# Altium project BMD_RevB_IDL_18_014.PrjPcb (part 1 of 2)
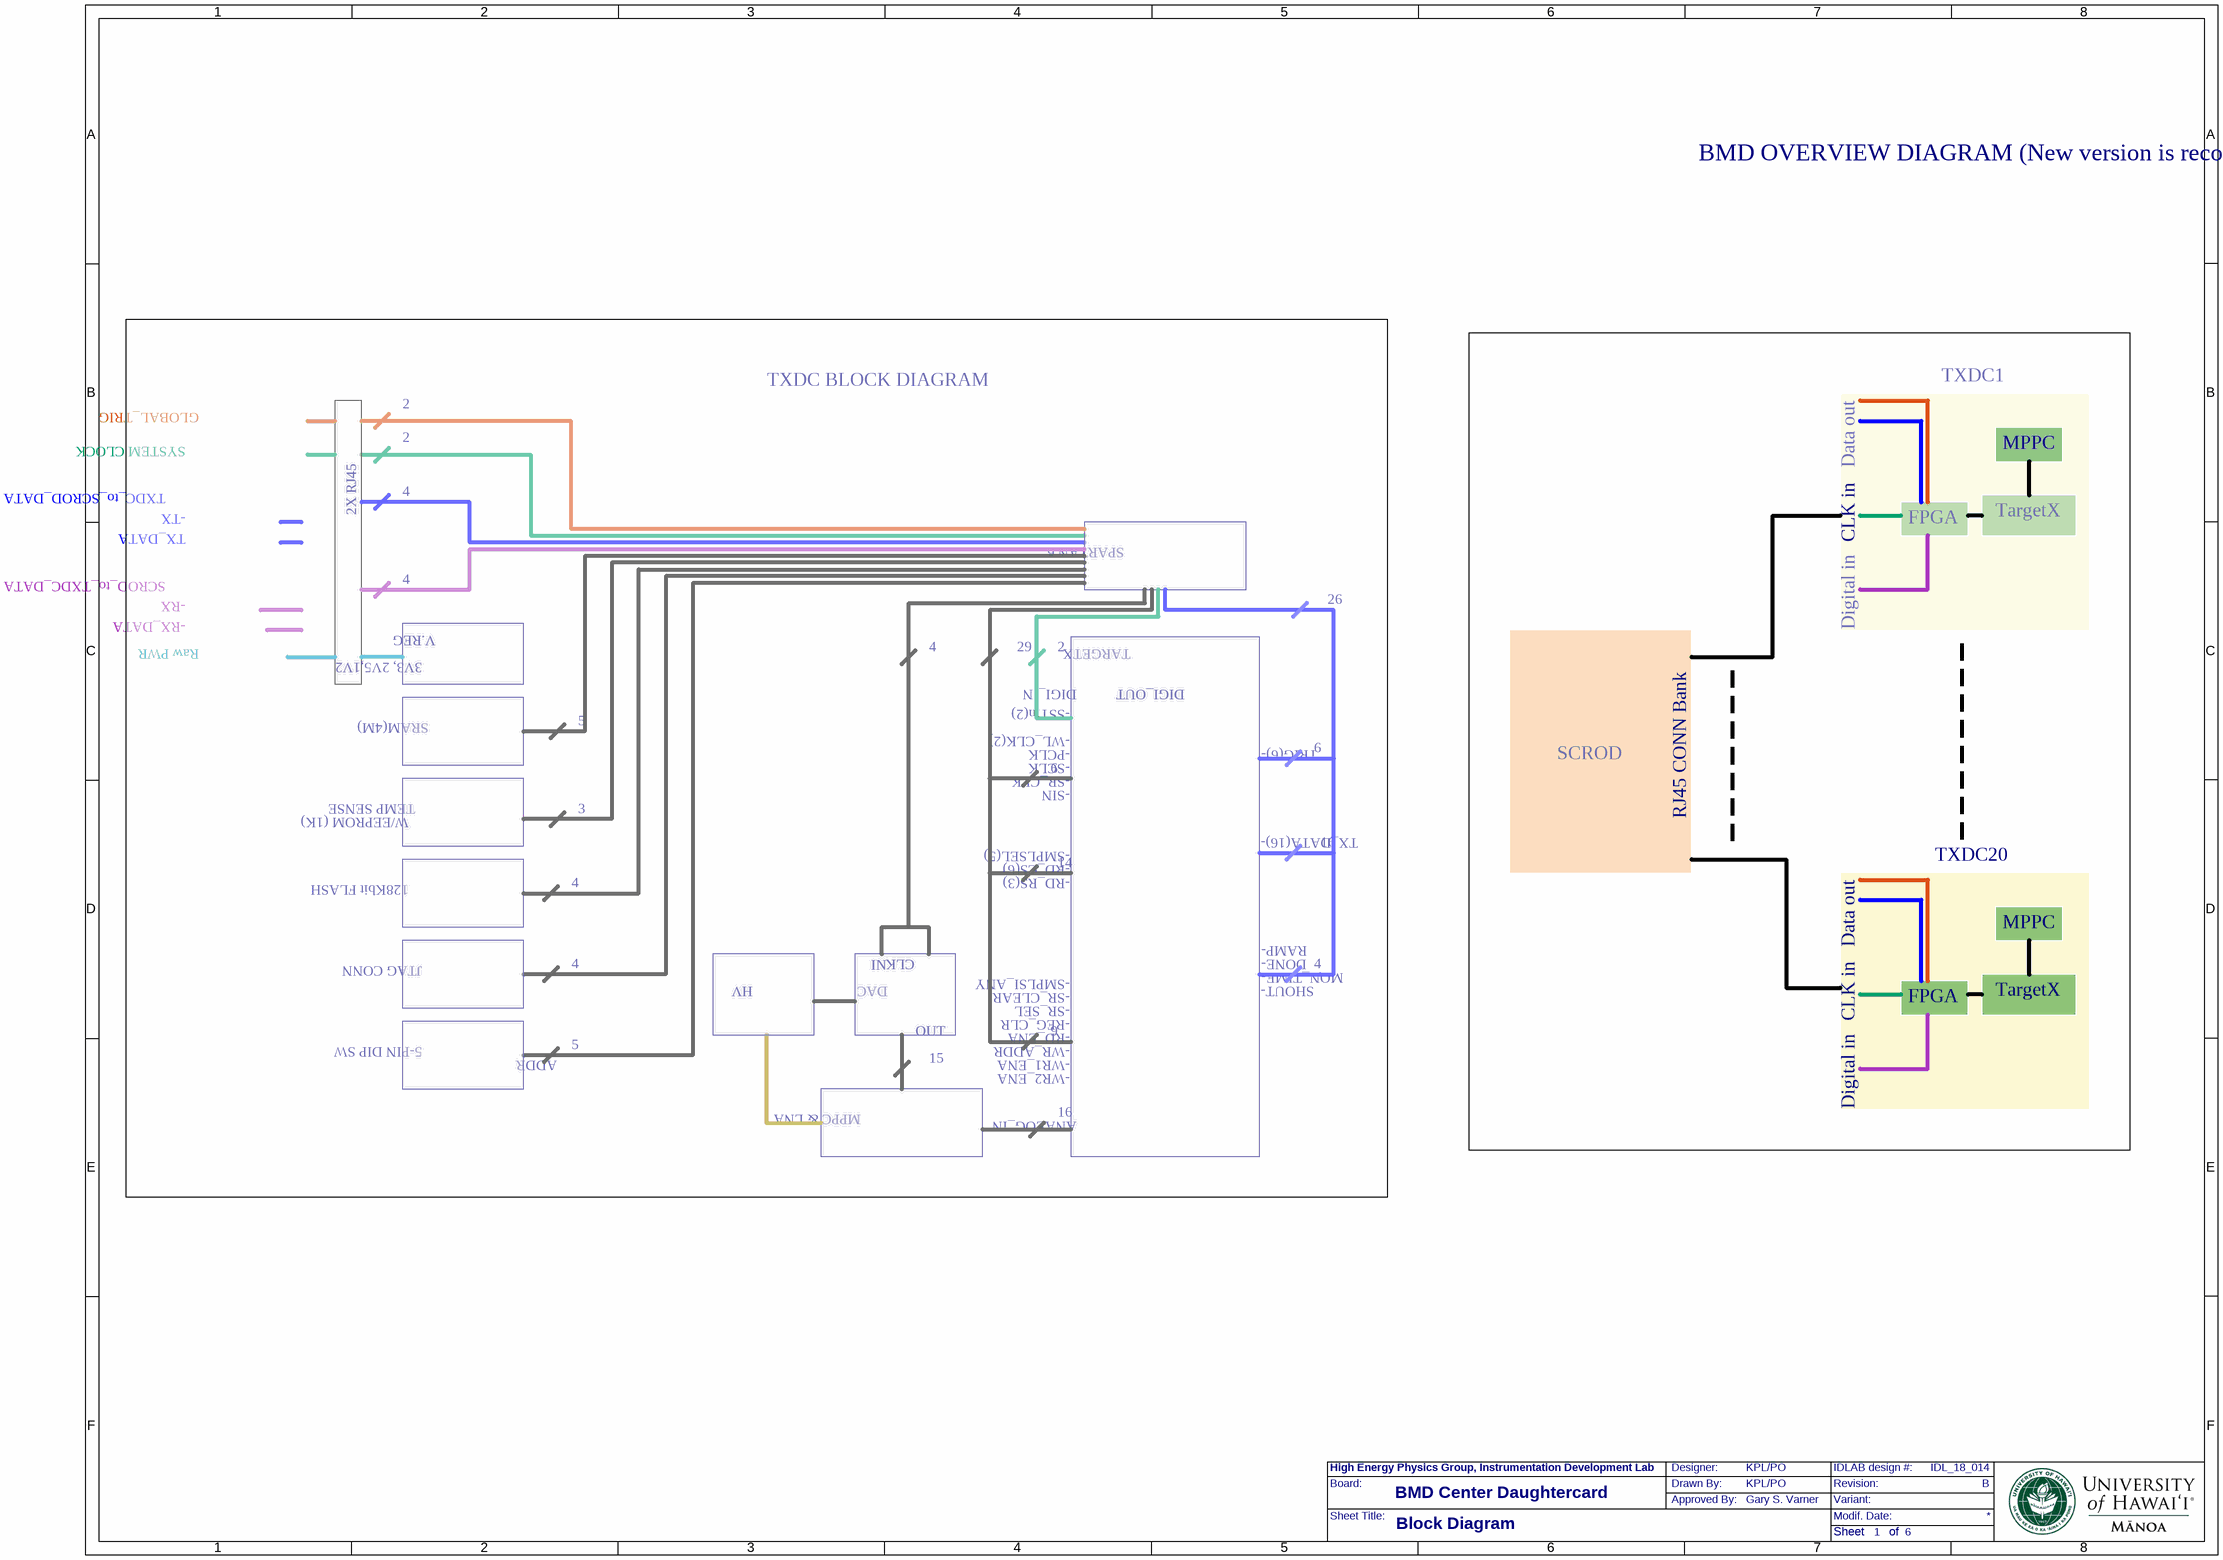
[diagram p0: BMD_RevB_B1_BD.SchDoc]
Approved_By: Gary S. Varner; BoardName: BMD Center Daughtercard; Designer: KPL/PO; Drawn_By: KPL/PO; IDLnum: IDL_18_014; ProjectName1: BMD_RevB; RevNum: B
7 sheets, 314 parts. Net scope: flat (ports and power ports of the same name join across sheets).
Board file: BMD_RevB_PCB.PcbDoc
Sheets:
  BMD_RevB_PRJHdr_IDL_18_014.SchDoc
  BMD_RevB_B1_BD.SchDoc
  BMD_RevB_B2_TX.SchDoc
  BMD_RevB_B3_FPGA.SchDoc
  BMD_RevB_B4_FPGA2.SchDoc
  BMD_RevB_B5_AMP.SchDoc
  BMD_RevB_B6_INOUT.SchDoc

## Sheet BMD_RevB_PRJHdr_IDL_18_014.SchDoc: BMD_RevB
size 401 x 291 mm; DocumentNumber: 1; SheetNumber: 1; SheetTotal: 3; Project_IT-Code: XXXX

### Notes on the sheet
- High Energy Physics Group
- Instrumentation Development Laboratory
- 2505 Correa Road, Honolulu, HI 96822
- Production Documentation for:
- Board Name:
- Project Name:
- IDL num:
- Revision:
- Variant:
- Designer:
- Drawn by:
- Approved by:
- Project name:
- High Energy Physics Group, Instrumentation Development Lab
- Drawn By:
- Approved By:
- IDLAB design #:
- Board name:
- Modif. Date:
- Sheet       of

## Sheet BMD_RevB_B1_BD.SchDoc: Block Diagram
size 401 x 291 mm; DocumentNumber: 3; SheetNumber: 1; SheetTotal: 6

### Notes on the sheet
- BMD OVERVIEW DIAGRAM (New version is reconfigured for the tracker planes on the HMB)
- TXDC BLOCK DIAGRAM
- GLOBAL_TRIG
- 2
- TXDC1
- TXDC_to_SCROD_DATA
- SYSTEM CLOCK
- 4
- Data out
- MPPC
- -TX
- TX_DATA
- 2X RJ45
- SPARTAN 6
- CLK in
- FPGA
- TargetX
- SCROD_to_TXDC_DATA
- -RX
- -RX_DATA
- 29
- 26
- Digital in
- Raw PWR
- 3V3, 2V5,1V2
- V.REG
- DIGI_IN
- TARGETX
- DIGI_OUT
- SRAM(4M)
- 5
- 6
- -WL_CLK(2)
- -SSTin(2)
- -PCLK
- -SCLK
- TRIG(6)-
- SCROD
- W/EEPROM (1K)
- TEMP SENSE
- 3
- -SR_CLK
- -SIN
- 16
- RJ45 CONN Bank
- 128Kbit FLASH
- 14
- -SMPLSEL(5)
- -RD_CS(6)
- -RD_RS(3)
- TX_DATA(16)-
- TXDC20
- IN
- CLK
- RAMP-
- DONE-
- JTAG CONN
- HV
- DAC
- OUT
- 15
- 9
- -SMPLSI_ANY
- -SR_CLEAR
- -SR_SEL
- -REG_CLR
- -RD_ENA
- MON_TIME-
- SHOUT-
- 5-PIN DIP SW
- ADDR
- -WR_ADDR
- -WR1_ENA
- -WR2_ENA
- MPPC & LNA
- ANALOG_IN
- Board:
- High Energy Physics Group, Instrumentation Development Lab
- Drawn By:
- Designer:
- Approved By:
- Revision:
- IDLAB design #:
- Variant:
- Sheet Title:
- Modif. Date:
- Sheet       of

## Sheet BMD_RevB_B2_TX.SchDoc: TargetX
size 401 x 291 mm; DocumentNumber: 2; SheetNumber: 2; SheetTotal: 6
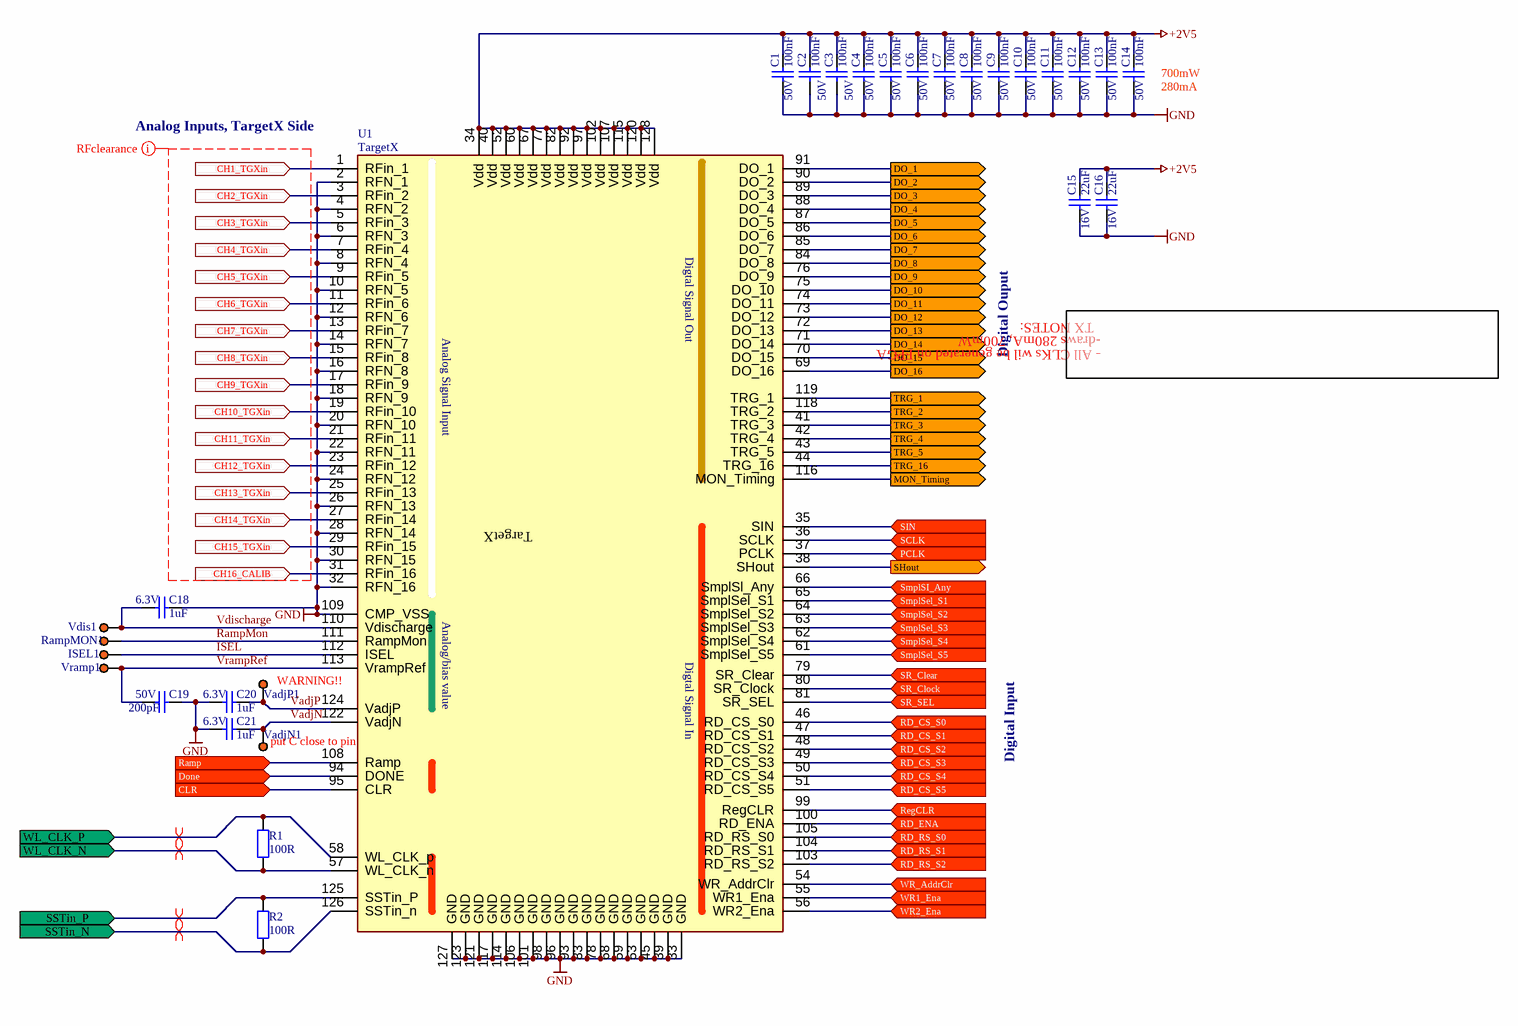
[diagram p1: BMD_RevB_B2_TX.SchDoc]

### Parts
C1  100nF  Voltage rating: 50V  [CC0402N1R]
C2  100nF  Voltage rating: 50V  [CC0402N1R]
C3  100nF  Voltage rating: 50V  [CC0402N1R]
C4  100nF  Voltage rating: 50V  [CC0402N1R]
C5  100nF  Voltage rating: 50V  [CC0402N1R]
C6  100nF  Voltage rating: 50V  [CC0402N1R]
C7  100nF  Voltage rating: 50V  [CC0402N1R]
C8  100nF  Voltage rating: 50V  [CC0402N1R]
C9  100nF  Voltage rating: 50V  [CC0402N1R]
C10  100nF  Voltage rating: 50V  [CC0402N1R]
C11  100nF  Voltage rating: 50V  [CC0402N1R]
C12  100nF  Voltage rating: 50V  [CC0402N1R]
C13  100nF  Voltage rating: 50V  [CC0402N1R]
C14  100nF  Voltage rating: 50V  [CC0402N1R]
C15  22uF  Voltage rating: 16V  [CC0805N1R]
C16  22uF  Voltage rating: 16V  [CC0805N1R]
C18  1uF  Voltage rating: 6.3V  [CC0402N1R]
C19  200pF  Voltage rating: 50V  [CC0402N1R]
C20  1uF  Voltage rating: 6.3V  [CC0402N1R]
C21  1uF  Voltage rating: 6.3V  [CC0402N1R]
ISEL1  SP1.5S  [SP1.5SQ]  (value not drawn)  (no BOM)
R1  100R  [RC0402N1R]
R2  100R  [RC0402N1R]
RampMON1  SP1.5S  [SP1.5SQ]  (value not drawn)  (no BOM)
U1  TargetX  [TQFP128_MZA]
VadjN1  SP1.5S  [SP1.5SQ]  (value not drawn)  (no BOM)
VadjP1  SP1.5S  [SP1.5SQ]  (value not drawn)  (no BOM)
Vdis1  SP1.5S  [SP1.5SQ]  (value not drawn)  (no BOM)
Vramp1  SP1.5S  [SP1.5SQ]  (value not drawn)  (no BOM)

### Ports
CH1_TGXin (in), CH2_TGXin (in), CH3_TGXin (in), CH4_TGXin (in), CH5_TGXin (in), CH6_TGXin (in), CH7_TGXin (in), CH8_TGXin (in), CH9_TGXin (in), CH10_TGXin (in), CH11_TGXin (in), CH12_TGXin (in), CH13_TGXin (in), CH14_TGXin (in), CH15_TGXin (in), CH16_CALIB (in), CLR (in), DO_1 (out), DO_2 (out), DO_3 (out), DO_4 (out), DO_5 (out), DO_6 (out), DO_7 (out), DO_8 (out), DO_9 (out), DO_10 (out), DO_11 (out), DO_12 (out), DO_13 (out), DO_14 (out), DO_15 (out), DO_16 (out), Done (in), MON_Timing (out), PCLK (in), Ramp (in), RD_CS_S0 (in), RD_CS_S1 (in), RD_CS_S2 (in), RD_CS_S3 (in), RD_CS_S4 (in), RD_CS_S5 (in), RD_ENA (in), RD_RS_S0 (in), RD_RS_S1 (in), RD_RS_S2 (in), RegCLR (in), SCLK (in), SHout (out), SIN (in), SmplSel_S1 (in), SmplSel_S2 (in), SmplSel_S3 (in), SmplSel_S4 (in), SmplSel_S5 (in), SmplSI_Any (in), SR_Clear (in), SR_Clock (in), SR_SEL (in), SSTin_N (in), SSTin_P (in), TRG_1 (out), TRG_2 (out), TRG_3 (out), TRG_4 (out), TRG_5 (out), TRG_16 (out), WL_CLK_N (in), WL_CLK_P (in), WR1_Ena (in), WR2_Ena (in), WR_AddrClr (in)

### Nets
+2V5: C1.2 C2.2 C3.2 C4.2 C5.2 C6.2 C7.2 C8.2 C9.2 C10.2 C11.2 C12.2 C13.2 C14.2 C15.2 C16.2 U1.34(Vdd) U1.40(Vdd) U1.52(Vdd) U1.60(Vdd) U1.67(Vdd) U1.77(Vdd) U1.82(Vdd) U1.92(Vdd) U1.97(Vdd) U1.102(Vdd) U1.107(Vdd) U1.115(Vdd) U1.120(Vdd) U1.128(Vdd)
GND: C1.1 C2.1 C3.1 C4.1 C5.1 C6.1 C7.1 C8.1 C9.1 C10.1 C11.1 C12.1 C13.1 C14.1 C15.1 C16.1 C18.2 C19.1 C20.1 C21.1 U1.2(RFN_1) U1.4(RFN_2) U1.6(RFN_3) U1.8(RFN_4) U1.10(RFN_5) U1.12(RFN_6) U1.14(RFN_7) U1.16(RFN_8) U1.18(RFN_9) U1.20(RFN_10) U1.22(RFN_11) U1.24(RFN_12) U1.26(RFN_13) U1.28(RFN_14) U1.30(RFN_15) U1.32(RFN_16) U1.33(GND) U1.39(GND) U1.45(GND) U1.53(GND) U1.59(GND) U1.68(GND) U1.78(GND) U1.83(GND) U1.93(GND) U1.96(GND) U1.98(GND) U1.101(GND) U1.106(GND) U1.109(CMP_VSS) U1.114(GND) U1.117(GND) U1.121(GND) U1.123(GND) U1.127(GND)
CH1_TGXin: U1.1(RFin_1) ; port CH1_TGXin
CH2_TGXin: U1.3(RFin_2) ; port CH2_TGXin
CH3_TGXin: U1.5(RFin_3) ; port CH3_TGXin
CH4_TGXin: U1.7(RFin_4) ; port CH4_TGXin
CH5_TGXin: U1.9(RFin_5) ; port CH5_TGXin
CH6_TGXin: U1.11(RFin_6) ; port CH6_TGXin
CH7_TGXin: U1.13(RFin_7) ; port CH7_TGXin
CH8_TGXin: U1.15(RFin_8) ; port CH8_TGXin
CH9_TGXin: U1.17(RFin_9) ; port CH9_TGXin
CH10_TGXin: U1.19(RFin_10) ; port CH10_TGXin
CH11_TGXin: U1.21(RFin_11) ; port CH11_TGXin
CH12_TGXin: U1.23(RFin_12) ; port CH12_TGXin
CH13_TGXin: U1.25(RFin_13) ; port CH13_TGXin
CH14_TGXin: U1.27(RFin_14) ; port CH14_TGXin
CH15_TGXin: U1.29(RFin_15) ; port CH15_TGXin
CH16_CALIB: U1.31(RFin_16) ; port CH16_CALIB
CLR: U1.95(CLR) ; port CLR
DO_1: U1.91(DO_1) ; port DO_1
DO_2: U1.90(DO_2) ; port DO_2
DO_3: U1.89(DO_3) ; port DO_3
DO_4: U1.88(DO_4) ; port DO_4
DO_5: U1.87(DO_5) ; port DO_5
DO_6: U1.86(DO_6) ; port DO_6
DO_7: U1.85(DO_7) ; port DO_7
DO_8: U1.84(DO_8) ; port DO_8
DO_9: U1.76(DO_9) ; port DO_9
DO_10: U1.75(DO_10) ; port DO_10
DO_11: U1.74(DO_11) ; port DO_11
DO_12: U1.73(DO_12) ; port DO_12
DO_13: U1.72(DO_13) ; port DO_13
DO_14: U1.71(DO_14) ; port DO_14
DO_15: U1.70(DO_15) ; port DO_15
DO_16: U1.69(DO_16) ; port DO_16
Done: U1.94(DONE) ; port Done
ISEL: ISEL1.1 U1.112(ISEL)  [project net ISEL_2]
MON_Timing: U1.116(MON_Timing) ; port MON_Timing
PCLK: U1.37(PCLK) ; port PCLK
Ramp: U1.108(Ramp) ; port Ramp
RampMon: RampMON1.1 U1.111(RampMon)  [project net RampMon_2]
RD_CS_S0: U1.46(RD_CS_S0) ; port RD_CS_S0
RD_CS_S1: U1.47(RD_CS_S1) ; port RD_CS_S1
RD_CS_S2: U1.48(RD_CS_S2) ; port RD_CS_S2
RD_CS_S3: U1.49(RD_CS_S3) ; port RD_CS_S3
RD_CS_S4: U1.50(RD_CS_S4) ; port RD_CS_S4
RD_CS_S5: U1.51(RD_CS_S5) ; port RD_CS_S5
RD_ENA: U1.100(RD_ENA) ; port RD_ENA
RD_RS_S0: U1.105(RD_RS_S0) ; port RD_RS_S0
RD_RS_S1: U1.104(RD_RS_S1) ; port RD_RS_S1
RD_RS_S2: U1.103(RD_RS_S2) ; port RD_RS_S2
RegCLR: U1.99(RegCLR) ; port RegCLR
SCLK: U1.36(SCLK) ; port SCLK
SHout: U1.38(SHout) ; port SHout
SIN: U1.35(SIN) ; port SIN
SmplSel_S1: U1.65(SmplSel_S1) ; port SmplSel_S1
SmplSel_S2: U1.64(SmplSel_S2) ; port SmplSel_S2
SmplSel_S3: U1.63(SmplSel_S3) ; port SmplSel_S3
SmplSel_S4: U1.62(SmplSel_S4) ; port SmplSel_S4
SmplSel_S5: U1.61(SmplSel_S5) ; port SmplSel_S5
SmplSI_Any: U1.66(SmplSl_Any) ; port SmplSI_Any
SR_Clear: U1.79(SR_Clear) ; port SR_Clear
SR_Clock: U1.80(SR_Clock) ; port SR_Clock
SR_SEL: U1.81(SR_SEL) ; port SR_SEL
SSTin_N: R2.1 U1.126(SSTin_n) ; port SSTin_N
SSTin_P: R2.2 U1.125(SSTin_P) ; port SSTin_P
TRG_1: U1.119(TRG_1) ; port TRG_1
TRG_2: U1.118(TRG_2) ; port TRG_2
TRG_3: U1.41(TRG_3) ; port TRG_3
TRG_4: U1.42(TRG_4) ; port TRG_4
TRG_5: U1.43(TRG_5) ; port TRG_5
TRG_16: U1.44(TRG_16) ; port TRG_16
VadjN: C21.2 U1.122(VadjN) VadjN1.1  [project net VadjN_2]
VadjP: C20.2 U1.124(VadjP) VadjP1.1  [project net VadjP_2]
Vdischarge: C18.1 U1.110(Vdischarge) Vdis1.1  [project net Vdischarge_2]
VrampRef: C19.2 U1.113(VrampRef) Vramp1.1  [project net VrampRef_2]
WL_CLK_N: R1.1 U1.57(WL_CLK_n) ; port WL_CLK_N
WL_CLK_P: R1.2 U1.58(WL_CLK_p) ; port WL_CLK_P
WR1_Ena: U1.55(WR1_Ena) ; port WR1_Ena
WR2_Ena: U1.56(WR2_Ena) ; port WR2_Ena
WR_AddrClr: U1.54(WR_AddrClr) ; port WR_AddrClr

### Layout directives
net class RF: (no net found under the mark)
differential pair: SSTin_N, SSTin_P, WL_CLK_N, WL_CLK_P

### Notes on the sheet
- (near C14) 700mW
- (near C14) 280mA
- (near U1) Analog Inputs, TargetX Side
- Digital Ouput
- TX NOTES:
- -draws 280mA, 700mW
- - All CLKs wil be generated on FPGA
- (near U1) TargetX
- (near VadjP1) WARNING!!
- (near U1) put C close to pin
- Digital Input
- Board:
- High Energy Physics Group, Instrumentation Development Lab
- Drawn By:
- Designer:
- Approved By:
- Revision:
- IDLAB design #:
- Variant:
- Sheet Title:
- Modif. Date:
- Sheet       of
- (in symbol DIGITZ_TargetX) Digtal Signal Out; Analog Signal Input; Analog/bias value; Digtal Signal In

### Library data of the parts
C1-C14 = CAPCC0402_100N_50VX7R: 0.10µF 50V Ceramic Capacitor X7R 0402; Manufacturer: TDK; Manufacturer No: C1005X7R1H104K050BB; Tech: SMDR; Package: Cap Chip 0402; Supplier 1: Digi-Key; Supplier Part Number 1: 445-5932-1-ND
C15 C16 = CAPCC0805_22U_16VX7R: 22µF 16V Ceramic Capacitor X5R 0805; Manufacturer: Murata; Manufacturer No: GRM219R61C226ME15L; Tech: SMDR; Package: Cap Chip 0805; Supplier 1: Digi-Key; Supplier Part Number 1: 490-9952-1-ND
C18 C20 C21 = CAPCC0402_1.0U_50VX7R: 1µF 6.3V Ceramic Capacitor X7R 0402; Manufacturer: TDK; Manufacturer No: GRM155R70J105KA12D; Tech: SMDR; Package: Cap Chip 0402; Supplier 1: Digi-Key; Supplier Part Number 1: 490-10024-1-ND
C19 = CAPCC0402_200P_50VNP0: Capacitor chip ceramic 0402 50V NPO; Manufacturer: Murata; Manufacturer No: GRM1555C1H201JA01D; Tech: SMDR; Package: Cap Chip 0402; Supplier 1: Digi-Key; Supplier Part Number 1: 490-3232-1-ND
ISEL1 RampMON1 VadjN1 VadjP1 Vdis1 Vramp1 = SP1.5S: Wire solder pin 1.5mm; Sort: 610; Tech: THDW; Price: 0
R1 R2 = RES0402-100R-1%100PPM: RES SMD 100 OHM 1% 1/10W 0402; Manufacturer: Panasonic; Manufacturer No: ERJ-2RKF1000X; Tech: SMDR; Package: Res Chip 0402; Supplier 1: Digi-Key; Supplier Part Number 1: P100LCT-ND
U1 = DIGITZ_TargetX: 16-channel, 1GSPS Transient Waveform Recorder; Manufacturer: UHM_IDL; Tech: SMDR; Manufacturer No: TargetX; Package: TQFP128; Supplier 1: UHM_IDL; Supplier Part Number 1: TargetX; Supplier Order Qty 1: 1; Supplier Unit Price 1: 0

## Sheet BMD_RevB_B3_FPGA.SchDoc: FPGA
size 401 x 291 mm; DocumentNumber: 2; SheetNumber: 3; SheetTotal: 6
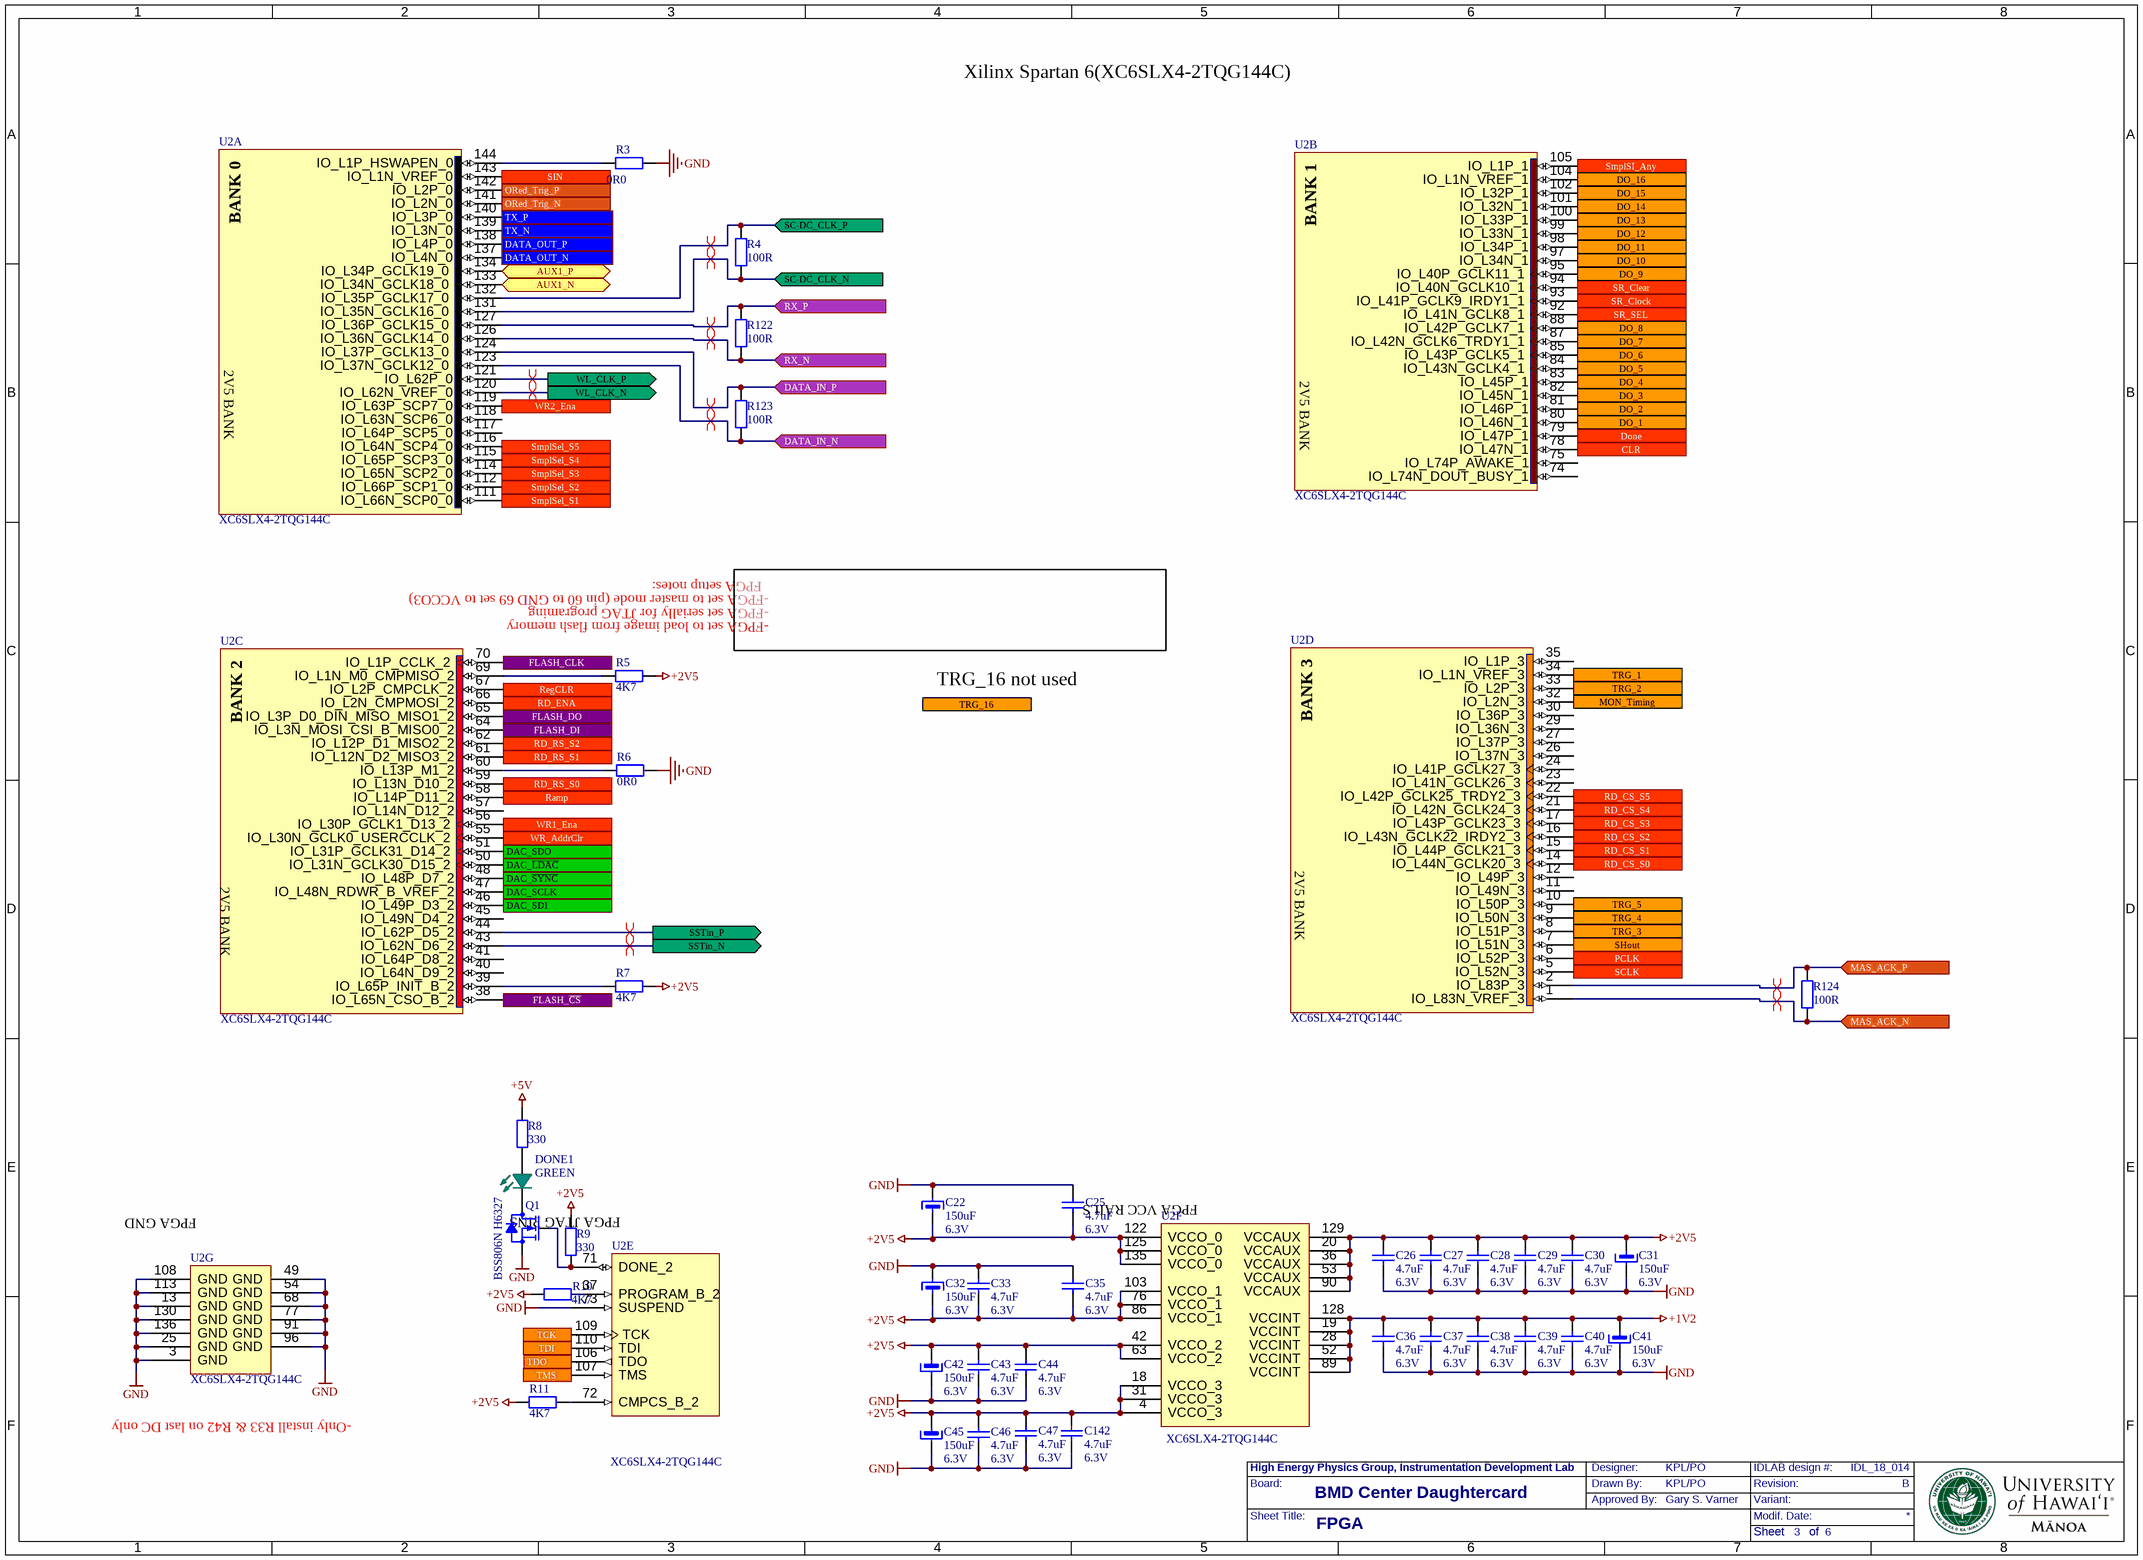
[diagram p2: BMD_RevB_B3_FPGA.SchDoc]

### Parts
C22  150uF  Voltage: 6.3V  [CTC-B3528-21]
C25  4.7uF  Voltage rating: 6.3V  [CC0402N1R]
C26  4.7uF  Voltage rating: 6.3V  [CC0402N1R]
C27  4.7uF  Voltage rating: 6.3V  [CC0402N1R]
C28  4.7uF  Voltage rating: 6.3V  [CC0402N1R]
C29  4.7uF  Voltage rating: 6.3V  [CC0402N1R]
C30  4.7uF  Voltage rating: 6.3V  [CC0402N1R]
C31  150uF  Voltage: 6.3V  [CTC-B3528-21]
C32  150uF  Voltage: 6.3V  [CTC-B3528-21]
C33  4.7uF  Voltage rating: 6.3V  [CC0402N1R]
C35  4.7uF  Voltage rating: 6.3V  [CC0402N1R]
C36  4.7uF  Voltage rating: 6.3V  [CC0402N1R]
C37  4.7uF  Voltage rating: 6.3V  [CC0402N1R]
C38  4.7uF  Voltage rating: 6.3V  [CC0402N1R]
C39  4.7uF  Voltage rating: 6.3V  [CC0402N1R]
C40  4.7uF  Voltage rating: 6.3V  [CC0402N1R]
C41  150uF  Voltage: 6.3V  [CTC-B3528-21]
C42  150uF  Voltage: 6.3V  [CTC-B3528-21]
C43  4.7uF  Voltage rating: 6.3V  [CC0402N1R]
C44  4.7uF  Voltage rating: 6.3V  [CC0402N1R]
C45  150uF  Voltage: 6.3V  [CTC-B3528-21]
C46  4.7uF  Voltage rating: 6.3V  [CC0402N1R]
C47  4.7uF  Voltage rating: 6.3V  [CC0402N1R]
C142  4.7uF  Voltage rating: 6.3V  [CC0402N1R]
DONE1  GREEN  [LED0603VG]
Q1  BSS806N H6327  [SOT23-1]
R3  0R0  [RC0402N1R]
R4  100R  [RC0402N1R]
R5  4K7  [RC0402N1R]
R6  0R0  [RC0402N1R]
R7  4K7  [RC0402N1R]
R8  330  [RC0402N1R]
R9  330  [RC0402N1R]
R10  4K7  [RC0402N1R]
R11  4K7  [RC0402N1R]
R122  100R  [RC0402N1R]
R123  100R  [RC0402N1R]
R124  100R  [RC0402N1R]
U2  XC6SLX4-2TQG144C  [TQG144_N]  (parts A,B,C,D,E,F,G of 7)

### Ports
AUX1_N (bidir), AUX1_P (bidir), CLR (out), DAC_SCLK (in), DAC_SDI (in), DAC_SDO (out), DAC_~{LDAC} (in), DAC_~{SYNC} (in), DATA_IN_N (in), DATA_IN_P (in), DATA_OUT_N (out), DATA_OUT_P (out), DO_1 (in), DO_2 (in), DO_3 (in), DO_4 (in), DO_5 (in), DO_6 (in), DO_7 (in), DO_8 (in), DO_9 (in), DO_10 (in), DO_11 (in), DO_12 (in), DO_13 (in), DO_14 (in), DO_15 (in), DO_16 (in), Done (out), FLASH_CLK (out), FLASH_DI (out), FLASH_DO (in), FLASH_~{CS} (out), MAS_ACK_N (in), MAS_ACK_P (in), MON_Timing (in), ORed_Trig_N (out), ORed_Trig_P (out), PCLK (out), Ramp (out), RD_CS_S0 (out), RD_CS_S1 (out), RD_CS_S2 (out), RD_CS_S3 (out), RD_CS_S4 (out), RD_CS_S5 (out), RD_ENA (out), RD_RS_S0 (out), RD_RS_S1 (out), RD_RS_S2 (out), RegCLR (out), RX_N (in), RX_P (in), SC-DC_CLK_N (in), SC-DC_CLK_P (in), SCLK (out), SHout (in), SIN (out), SmplSel_S1 (out), SmplSel_S2 (out), SmplSel_S3 (out), SmplSel_S4 (out), SmplSel_S5 (out), SmplSI_Any (out), SR_Clear (out), SR_Clock (out), SR_SEL (out), SSTin_N (out), SSTin_P (out), TCK (in), TDI (in), TDO (out), TMS (in), TRG_1 (in), TRG_2 (in), TRG_3 (in), TRG_4 (in), TRG_5 (in), TRG_16 (in), TX_N (out), TX_P (out), WL_CLK_N (out), WL_CLK_P (out), WR1_Ena (out), WR2_Ena (out), WR_AddrClr (out)

### Nets
+1V2: C36.2 C37.2 C38.2 C39.2 C40.2 C41.1 U2.19(VCCINT) U2.28(VCCINT) U2.52(VCCINT) U2.89(VCCINT) U2.128(VCCINT)
+2V5: C22.1 C25.1 C26.2 C27.2 C28.2 C29.2 C30.2 C31.1 C32.1 C33.1 C35.1 C42.1 C43.2 C44.2 C45.1 C46.2 C47.2 C142.2 R5.2 R7.2 R9.1 R10.2 R11.1 U2.4(VCCO_3) U2.18(VCCO_3) U2.20(VCCAUX) U2.31(VCCO_3) U2.36(VCCAUX) U2.42(VCCO_2) U2.53(VCCAUX) U2.63(VCCO_2) U2.76(VCCO_1) U2.86(VCCO_1) U2.90(VCCAUX) U2.103(VCCO_1) U2.122(VCCO_0) U2.125(VCCO_0) U2.129(VCCAUX) U2.135(VCCO_0)
+5V: R8.1
GND: C22.2 C25.2 C26.1 C27.1 C28.1 C29.1 C30.1 C31.2 C32.2 C33.2 C35.2 C36.1 C37.1 C38.1 C39.1 C40.1 C41.2 C42.2 C43.1 C44.1 C45.2 C46.1 C47.1 C142.1 Q1.2(S) R3.2 R6.2 U2.3(GND) U2.13(GND) U2.25(GND) U2.49(GND) U2.54(GND) U2.68(GND) U2.73(SUSPEND) U2.77(GND) U2.91(GND) U2.96(GND) U2.108(GND) U2.113(GND) U2.130(GND) U2.136(GND)
AUX1_N: U2.133(IO_L34N_GCLK18_0) ; port AUX1_N
AUX1_P: U2.134(IO_L34P_GCLK19_0) ; port AUX1_P
CLR: U2.78(IO_L47N_1) ; port CLR
DAC_~{LDAC}: U2.50(IO_L31N_GCLK30_D15_2) ; port DAC_~{LDAC}
DAC_~{SYNC}: U2.48(IO_L48P_D7_2) ; port DAC_~{SYNC}
DAC_SCLK: U2.47(IO_L48N_RDWR_B_VREF_2) ; port DAC_SCLK
DAC_SDI: U2.46(IO_L49P_D3_2) ; port DAC_SDI
DAC_SDO: U2.51(IO_L31P_GCLK31_D14_2) ; port DAC_SDO
DATA_IN_N: R123.1 U2.123(IO_L37N_GCLK12_0) ; port DATA_IN_N
DATA_IN_P: R123.2 U2.124(IO_L37P_GCLK13_0) ; port DATA_IN_P
DATA_OUT_N: U2.137(IO_L4N_0) ; port DATA_OUT_N
DATA_OUT_P: U2.138(IO_L4P_0) ; port DATA_OUT_P
DO_1: U2.80(IO_L46N_1) ; port DO_1
DO_2: U2.81(IO_L46P_1) ; port DO_2
DO_3: U2.82(IO_L45N_1) ; port DO_3
DO_4: U2.83(IO_L45P_1) ; port DO_4
DO_5: U2.84(IO_L43N_GCLK4_1) ; port DO_5
DO_6: U2.85(IO_L43P_GCLK5_1) ; port DO_6
DO_7: U2.87(IO_L42N_GCLK6_TRDY1_1) ; port DO_7
DO_8: U2.88(IO_L42P_GCLK7_1) ; port DO_8
DO_9: U2.95(IO_L40P_GCLK11_1) ; port DO_9
DO_10: U2.97(IO_L34N_1) ; port DO_10
DO_11: U2.98(IO_L34P_1) ; port DO_11
DO_12: U2.99(IO_L33N_1) ; port DO_12
DO_13: U2.100(IO_L33P_1) ; port DO_13
DO_14: U2.101(IO_L32N_1) ; port DO_14
DO_15: U2.102(IO_L32P_1) ; port DO_15
DO_16: U2.104(IO_L1N_VREF_1) ; port DO_16
Done: U2.79(IO_L47P_1) ; port Done
FLASH_~{CS}: U2.38(IO_L65N_CSO_B_2) ; port FLASH_~{CS}
FLASH_CLK: U2.70(IO_L1P_CCLK_2) ; port FLASH_CLK
FLASH_DI: U2.64(IO_L3N_MOSI_CSI_B_MISO0_2) ; port FLASH_DI
FLASH_DO: U2.65(IO_L3P_D0_DIN_MISO_MISO1_2) ; port FLASH_DO
MAS_ACK_N: R124.1 U2.1(IO_L83N_VREF_3) ; port MAS_ACK_N
MAS_ACK_P: R124.2 U2.2(IO_L83P_3) ; port MAS_ACK_P
MON_Timing: U2.32(IO_L2N_3) ; port MON_Timing
ORed_Trig_N: U2.141(IO_L2N_0) ; port ORed_Trig_N
ORed_Trig_P: U2.142(IO_L2P_0) ; port ORed_Trig_P
PCLK: U2.6(IO_L52P_3) ; port PCLK
Ramp: U2.58(IO_L14P_D11_2) ; port Ramp
RD_CS_S0: U2.14(IO_L44N_GCLK20_3) ; port RD_CS_S0
RD_CS_S1: U2.15(IO_L44P_GCLK21_3) ; port RD_CS_S1
RD_CS_S2: U2.16(IO_L43N_GCLK22_IRDY2_3) ; port RD_CS_S2
RD_CS_S3: U2.17(IO_L43P_GCLK23_3) ; port RD_CS_S3
RD_CS_S4: U2.21(IO_L42N_GCLK24_3) ; port RD_CS_S4
RD_CS_S5: U2.22(IO_L42P_GCLK25_TRDY2_3) ; port RD_CS_S5
RD_ENA: U2.66(IO_L2N_CMPMOSI_2) ; port RD_ENA
RD_RS_S0: U2.59(IO_L13N_D10_2) ; port RD_RS_S0
RD_RS_S1: U2.61(IO_L12N_D2_MISO3_2) ; port RD_RS_S1
RD_RS_S2: U2.62(IO_L12P_D1_MISO2_2) ; port RD_RS_S2
RegCLR: U2.67(IO_L2P_CMPCLK_2) ; port RegCLR
RX_N: R122.1 U2.126(IO_L36N_GCLK14_0) ; port RX_N
RX_P: R122.2 U2.127(IO_L36P_GCLK15_0) ; port RX_P
SC-DC_CLK_N: R4.1 U2.131(IO_L35N_GCLK16_0) ; port SC-DC_CLK_N
SC-DC_CLK_P: R4.2 U2.132(IO_L35P_GCLK17_0) ; port SC-DC_CLK_P
SCLK: U2.5(IO_L52N_3) ; port SCLK
SHout: U2.7(IO_L51N_3) ; port SHout
SIN: U2.143(IO_L1N_VREF_0) ; port SIN
SmplSel_S1: U2.111(IO_L66N_SCP0_0) ; port SmplSel_S1
SmplSel_S2: U2.112(IO_L66P_SCP1_0) ; port SmplSel_S2
SmplSel_S3: U2.114(IO_L65N_SCP2_0) ; port SmplSel_S3
SmplSel_S4: U2.115(IO_L65P_SCP3_0) ; port SmplSel_S4
SmplSel_S5: U2.116(IO_L64N_SCP4_0) ; port SmplSel_S5
SmplSI_Any: U2.105(IO_L1P_1) ; port SmplSI_Any
SR_Clear: U2.94(IO_L40N_GCLK10_1) ; port SR_Clear
SR_Clock: U2.93(IO_L41P_GCLK9_IRDY1_1) ; port SR_Clock
SR_SEL: U2.92(IO_L41N_GCLK8_1) ; port SR_SEL
SSTin_N: U2.43(IO_L62N_D6_2) ; port SSTin_N
SSTin_P: U2.44(IO_L62P_D5_2) ; port SSTin_P
TCK: U2.109(TCK) ; port TCK
TDI: U2.110(TDI) ; port TDI
TDO: U2.106(TDO) ; port TDO
TMS: U2.107(TMS) ; port TMS
TRG_1: U2.34(IO_L1N_VREF_3) ; port TRG_1
TRG_2: U2.33(IO_L2P_3) ; port TRG_2
TRG_3: U2.8(IO_L51P_3) ; port TRG_3
TRG_4: U2.9(IO_L50N_3) ; port TRG_4
TRG_5: U2.10(IO_L50P_3) ; port TRG_5
TX_N: U2.139(IO_L3N_0) ; port TX_N
TX_P: U2.140(IO_L3P_0) ; port TX_P
WL_CLK_N: U2.120(IO_L62N_VREF_0) ; port WL_CLK_N
WL_CLK_P: U2.121(IO_L62P_0) ; port WL_CLK_P
WR1_Ena: U2.56(IO_L30P_GCLK1_D13_2) ; port WR1_Ena
WR2_Ena: U2.119(IO_L63P_SCP7_0) ; port WR2_Ena
WR_AddrClr: U2.55(IO_L30N_GCLK0_USERCCLK_2) ; port WR_AddrClr
NetDONE1_1: DONE1.1(C) Q1.3(D)
NetDONE1_2: DONE1.2(A) R8.2
NetQ1_1: Q1.1(G) R9.2 U2.71(DONE_2)
NetR3_1: R3.1 U2.144(IO_L1P_HSWAPEN_0)
NetR5_1: R5.1 U2.69(IO_L1N_M0_CMPMISO_2)
NetR6_1: R6.1 U2.60(IO_L13P_M1_2)
NetR7_1: R7.1 U2.39(IO_L65P_INIT_B_2)
NetR10_1: R10.1 U2.37(PROGRAM_B_2)
NetR11_2: R11.2 U2.72(CMPCS_B_2)

Not connected (* = marked no-connect by the designer): U2 11(IO_L49N_3) 12(IO_L49P_3) 23(IO_L41N_GCLK26_3) 24(IO_L41P_GCLK27_3) 26(IO_L37N_3) 27(IO_L37P_3) 29(IO_L36N_3) 30(IO_L36P_3) 35(IO_L1P_3) 40(IO_L64N_D9_2) 41(IO_L64P_D8_2) 45(IO_L49N_D4_2) 57(IO_L14N_D12_2) 74(IO_L74N_DOUT_BUSY_1) 75(IO_L74P_AWAKE_1) 117(IO_L64P_SCP5_0) 118(IO_L63N_SCP6_0)

### Layout directives
differential pair: DATA_IN_N, DATA_IN_P, MAS_ACK_N, MAS_ACK_P, RX_N, RX_P, SC-DC_CLK_N, SC-DC_CLK_P, SSTin_N, SSTin_P, WL_CLK_N, WL_CLK_P

### Notes on the sheet
- Xilinx Spartan 6(XC6SLX4-2TQG144C)
- 2V5 BANK
- FPGA setup notes:
- -FPGA set to master mode (pin 60 to GND 69 set to VCCO3)
- -FPGA set serially for JTAG programing
- -FPGA set to load image from flash memory
- TRG_16 not used
- (near U2) FPGA GND
- FPGA JTAG PINS
- (near U2) FPGA VCC RAILS
- -Only install R33 & R42 on last DC only
- Board:
- High Energy Physics Group, Instrumentation Development Lab
- Drawn By:
- Designer:
- Approved By:
- Revision:
- IDLAB design #:
- Variant:
- Sheet Title:
- Modif. Date:
- Sheet       of
- (in symbol SPARTAN_6, part A) BANK 0
- (in symbol SPARTAN_6, part B) BANK 1
- (in symbol SPARTAN_6, part C) BANK 2
- (in symbol SPARTAN_6, part D) BANK 3

### Library data of the parts
C22 C31 C32 C41 C42 C45 = CAPT3528_150U6V3R0.5: 150µF Molded Tantalum Capacitors 6.3V 1411; Manufacturer: AVX; Manufacturer No: F930J157MBA; Comment2: 6.3V 0.5R  20%; Tech: SMDR; Package: Tant SMD B 3528-21; Supplier 1: Digi-Key; Supplier Part Number 1: 493-5741-1-ND
C25-C30 C33 C35-C40 C43 C44 C46 C47 C142 = CAPCC0402_4.7uF_6.3V: 4.7µF ±10% 6.3V X7R Ceramic Capacitor; Manufacturer: Samsung Electro-Mechanics America, Inc.; Manufacturer No: CL05A475KQ5NRNC; Tech: SMDR; Package: Cap Chip 0402; Supplier 1: Digi-Key; Supplier Part Number 1: 1276-1481-1-ND
DONE1 = LED-GREEN0603H: Green 572nm LED Indication - Discrete 2.2V 0603; Manufacturer: Rohm Semiconductor; Manufacturer No: SML-D12M8WT86; Tech: SMDR; Package: Led Chip 0603 Side; Supplier 1: Digi-Key; Supplier Part Number 1: 511-1578-6-ND
Q1 = MOSFET_N_Channel: MOSFET N-CH 20V 2.3A SOT23; Manufacturer: Infineon Technologies; Tech: SMDR; Package: SOT23; Manufacturer No: BSS806N H6327; Supplier 1: Digi-Key; Supplier Part Number 1: BSS806N H6327CT-ND
R3 R6 = RES0402-0R-1%100PPM: Chip Resistor 0402 62.5mW 1% 100ppm; Manufacturer: Panasonic; Manufacturer No: ERJ-2GE0R00X; Tech: SMDR; Package: Res Chip 0402; Supplier 1: Digi-Key; Supplier Part Number 1: P0.0JCT-ND
R4 R122-R124 = RES0402-100R-1%100PPM: as R1 on sheet BMD_RevB_B2_TX; Package: Res Chip 0402; Supplier 1: Digi-Key; Supplier Part Number 1: P100LCT-ND
R5 R7 R10 R11 = RES0402-4.7K-1%100PPM: RES SMD 4.7K OHM 1% 1/10W 0402; Manufacturer: Panasonic; Manufacturer No: ERJ-2RKF4701X; Tech: SMDR; Package: Res Chip 0402; Supplier 1: Digi-Key; Supplier Part Number 1: P4.70KLCT-ND
R8 R9 = RES0402_330_1%: RES SMD 330 OHM 0.1% 1/16W 0402; Manufacturer: Panasonic Electronic Components; Manufacturer No: ERA-2AEB331X; Tech: SMDR; Supplier 1: Digi-Key; Supplier Part Number 1: P330DCDKR-ND
U2 = SPARTAN_6: Spartan-6 LX 1.2V FPGA, 102 User I/Os, 144-Pin TQFP (0.5mm Pitch), Speed Grade 2, Commercial Grade, Pb-Free; Manufacturer: Xillinx Inc; Published: 1-Jul-2010; DatasheetVersion: ver1.6, Nov-2010; PackageVersion: ver1.2, Jun-2004; PackageReference: TQG144; Publisher: Altium Limited; PackageDescription: 144-Pin Thin Quad Flat Pack (TQG144) - Pb-Free; Supplier 1: Digi-Key; Supplier Part Number 1: 122-1734-ND; Code_JEDEC: MS-026-BFB; ComponentLink1Description: Manufacturer Link; ComponentLink1URL: http://www.xilinx.com; ComponentLink2Description: Spartan-6 Datasheet; ComponentLink2URL: http://www.xilinx.com/support/documentation/data_sheets/ds160.pdf; ComponentLink3Description: Spartan-6 Documents; ComponentLink3URL: http://www.xilinx.com/support/documentation/spartan-6.htm; ComponentLink4Description: Xilinx.com Home; ComponentLink4URL: http://www.xilinx.com; Manufacturer No: XC6SLX4-2TQG144C

## Sheet BMD_RevB_B4_FPGA2.SchDoc: FPGA2
size 401 x 291 mm; DocumentNumber: 2; SheetNumber: 4; SheetTotal: 6
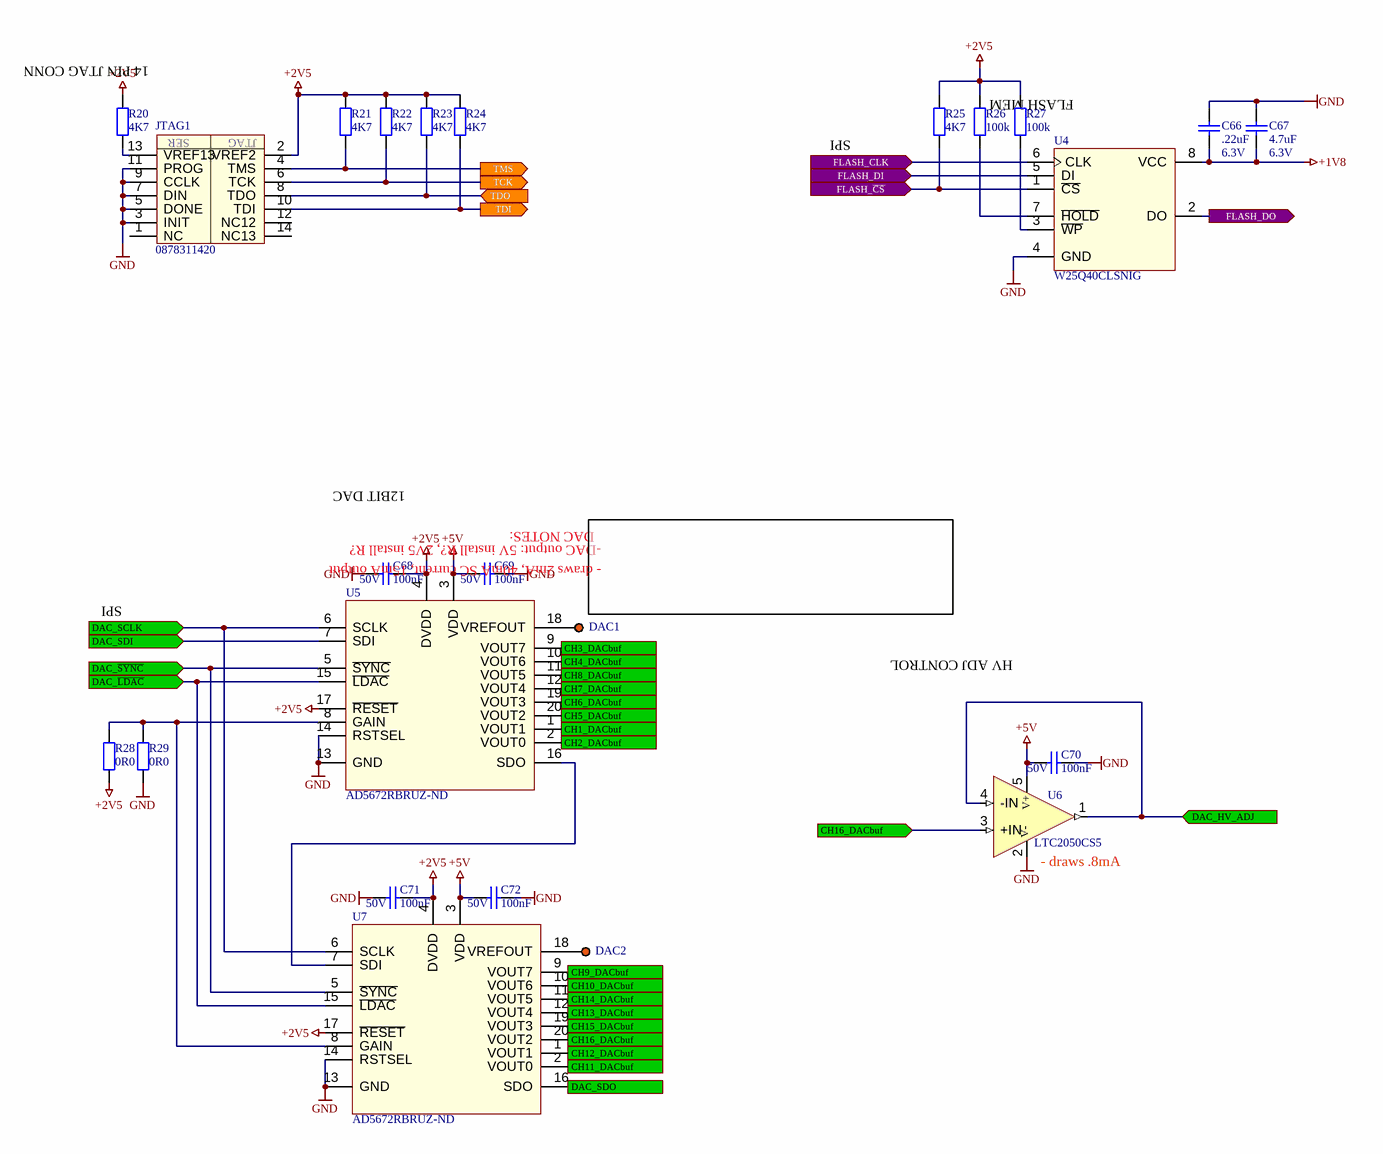
[diagram p3: BMD_RevB_B4_FPGA2.SchDoc]

### Parts
C66  .22uF  Voltage rating: 6.3V  [CC0402N1R]
C67  4.7uF  Voltage rating: 6.3V  [CC0402N1R]
C68  100nF  Voltage rating: 50V  [CC0402N1R]
C69  100nF  Voltage rating: 50V  [CC0402N1R]
C70  100nF  Voltage rating: 50V  [CC0402N1R]
C71  100nF  Voltage rating: 50V  [CC0402N1R]
C72  100nF  Voltage rating: 50V  [CC0402N1R]
DAC1  SP1.5S  [SP1.5SQ]  (value not drawn)  (no BOM)
DAC2  SP1.5S  [SP1.5SQ]  (value not drawn)  (no BOM)
JTAG1  0878311420  [JTAG_14PIN_2MM_VERT]
R20  4K7  [RC0402N1R]
R21  4K7  [RC0402N1R]
R22  4K7  [RC0402N1R]
R23  4K7  [RC0402N1R]
R24  4K7  [RC0402N1R]
R25  4K7  [RC0402N1R]
R26  100k  [RC0603N1R]
R27  100k  [RC0603N1R]
R28  0R0  [RC0603N1R]
R29  0R0  [RC0603N1R]
U4  W25Q40CLSNIG  [SOIC_8PIN]
U5  AD5672RBRUZ-ND  [TSSOP_20PIN]
U6  LTC2050CS5  [SOT23-5]
U7  AD5672RBRUZ-ND  [TSSOP_20PIN]

### Ports
CH1_DACbuf (out), CH2_DACbuf (out), CH3_DACbuf (out), CH4_DACbuf (out), CH5_DACbuf (out), CH6_DACbuf (out), CH7_DACbuf (out), CH8_DACbuf (out), CH9_DACbuf (out), CH10_DACbuf (out), CH11_DACbuf (out), CH12_DACbuf (out), CH13_DACbuf (out), CH14_DACbuf (out), CH15_DACbuf (out), CH16_DACbuf (in), CH16_DACbuf (out), DAC_HV_ADJ (in), DAC_SCLK (in), DAC_SDI (in), DAC_SDO (out), DAC_~{LDAC} (in), DAC_~{SYNC} (in), FLASH_CLK (in), FLASH_DI (in), FLASH_DO (out), FLASH_~{CS} (in), TCK (out), TDI (out), TDO (in), TMS (out)

### Nets
+1V8: C66.1 C67.1 U4.8(VCC)
+2V5: C68.1 C71.1 JTAG1.2(VREF2) R20.2 R21.2 R22.2 R23.2 R24.2 R25.2 R26.2 R27.2 R28.2 U5.4(DVDD) U5.17(~{RESET}) U7.4(DVDD) U7.17(~{RESET})
+5V: C69.2 C70.2 C72.2 U5.3(VDD) U6.5(V+) U7.3(VDD)
GND: C66.2 C67.2 C68.2 C69.1 C70.1 C71.2 C72.1 JTAG1.3(INIT) JTAG1.5(DONE) JTAG1.7(DIN) JTAG1.9(CCLK) JTAG1.11(PROG) R29.2 U4.4(GND) U5.13(GND) U5.14(RSTSEL) U6.2(V-) U7.13(GND) U7.14(RSTSEL)
CH1_DACbuf: U5.1(VOUT1) ; port CH1_DACbuf
CH2_DACbuf: U5.2(VOUT0) ; port CH2_DACbuf
CH3_DACbuf: U5.9(VOUT7) ; port CH3_DACbuf
CH4_DACbuf: U5.10(VOUT6) ; port CH4_DACbuf
CH5_DACbuf: U5.20(VOUT2) ; port CH5_DACbuf
CH6_DACbuf: U5.19(VOUT3) ; port CH6_DACbuf
CH7_DACbuf: U5.12(VOUT4) ; port CH7_DACbuf
CH8_DACbuf: U5.11(VOUT5) ; port CH8_DACbuf
CH9_DACbuf: U7.9(VOUT7) ; port CH9_DACbuf
CH10_DACbuf: U7.10(VOUT6) ; port CH10_DACbuf
CH11_DACbuf: U7.2(VOUT0) ; port CH11_DACbuf
CH12_DACbuf: U7.1(VOUT1) ; port CH12_DACbuf
CH13_DACbuf: U7.12(VOUT4) ; port CH13_DACbuf
CH14_DACbuf: U7.11(VOUT5) ; port CH14_DACbuf
CH15_DACbuf: U7.19(VOUT3) ; port CH15_DACbuf
CH16_DACbuf: U6.3(+IN) U7.20(VOUT2) ; port CH16_DACbuf
DAC_HV_ADJ: U6.1(OUT) U6.4(-IN) ; port DAC_HV_ADJ
DAC_~{LDAC}: U5.15(~{LDAC}) U7.15(~{LDAC}) ; port DAC_~{LDAC}
DAC_~{SYNC}: U5.5(~{SYNC}) U7.5(~{SYNC}) ; port DAC_~{SYNC}
DAC_SCLK: U5.6(SCLK) U7.6(SCLK) ; port DAC_SCLK
DAC_SDI: U5.7(SDI) ; port DAC_SDI
DAC_SDO: U7.16(SDO) ; port DAC_SDO
FLASH_~{CS}: R25.1 U4.1(~{CS}) ; port FLASH_~{CS}
FLASH_CLK: U4.6(CLK) ; port FLASH_CLK
FLASH_DI: U4.5(DI) ; port FLASH_DI
FLASH_DO: U4.2(DO) ; port FLASH_DO
TCK: JTAG1.6(TCK) R22.1 ; port TCK
TDI: JTAG1.10(TDI) R24.1 ; port TDI
TDO: JTAG1.8(TDO) R23.1 ; port TDO
TMS: JTAG1.4(TMS) R21.1 ; port TMS
NetDAC1_1: DAC1.1 U5.18(VREFOUT)
NetDAC2_1: DAC2.1 U7.18(VREFOUT)
NetJTAG1_13: JTAG1.13(VREF13) R20.1
NetR26_1: R26.1 U4.7(~{HOLD})
NetR27_1: R27.1 U4.3(~{WP})
NetR28_1: R28.1 R29.1 U5.8(GAIN) U7.8(GAIN)
NetU5_16: U5.16(SDO) U7.7(SDI)

Not connected (* = marked no-connect by the designer): JTAG1 1(NC) 12(NC12) 14(NC13)

### Notes on the sheet
- (near R20) 14 PIN JTAG CONN
- FLASH MEM
- SPI
- 12BIT DAC
- DAC NOTES:
- -DAC output: 5V install R?, 2V5 install R?
- - draws 2mA, 40mA SC current, 15mA output
- HV ADJ CONTROL
- (near U6) - draws .8mA
- Board:
- High Energy Physics Group, Instrumentation Development Lab
- Drawn By:
- Designer:
- Approved By:
- Revision:
- IDLAB design #:
- Variant:
- Sheet Title:
- Modif. Date:
- Sheet       of
- (in symbol 14PIN JTAG) SER; JTAG

### Library data of the parts
C66 = CAPCC0402_.22uF_6.3V: .22µF ±10% 6.3V X7R Ceramic Capacitor; Manufacturer: Samsung Electro-Mechanics America, Inc.; Manufacturer No: CL05A224KQ5NNNC; Tech: SMDR; Package: Cap Chip 0402; Supplier 1: Digi-Key; Supplier Part Number 1: 1276-1124-1-ND
C67 = CAPCC0402_4.7uF_6.3V: as C25 on sheet BMD_RevB_B3_FPGA; Package: Cap Chip 0402; Supplier 1: Digi-Key; Supplier Part Number 1: 1276-1481-1-ND
C68-C72 = CAPCC0402_100N_50VX7R: as C1 on sheet BMD_RevB_B2_TX; Package: Cap Chip 0402; Supplier 1: Digi-Key; Supplier Part Number 1: 445-5932-1-ND
DAC1 DAC2 = SP1.5S: as ISEL1 on sheet BMD_RevB_B2_TX; Price: 0
JTAG1 = 14PIN JTAG: 14 Positions Header, Shrouded Connector 0.079" (2.00mm) Through Hole Gold; Manufacturer: Molex, LLC; Tech: SMDR; Manufacturer No: 0878311420; Supplier 1: Digi-Key; Supplier Part Number 1: WM17469-ND
R20-R25 = RES0402-4.7K-1%100PPM: as R5 on sheet BMD_RevB_B3_FPGA; Package: Res Chip 0402; Supplier 1: Digi-Key; Supplier Part Number 1: P4.70KLCT-ND
R26 R27 = PR_RES0603-1_100k-0.1%25PPM: Chip Resistor 0603 100mW 0.1% 25ppm; Manufacturer: Panasonic; Manufacturer No: ERA-3AEB104V; Tech: SMDR; Package: Res Chip 0603; Supplier 1: Digi-Key; Supplier Part Number 1: P100KDBCT-ND; Supplier 2: Newark; Supplier Part Number 2: 08N2096; Supplier 3: Mouser; Supplier Part Number 3: 667-ERA-3AEB104V
R28 R29 = RES0603-0R0-1%100PPM: RES SMD 0.0OHM JUMPER 1/10W 0603; Manufacturer: Panasonic; Manufacturer No: ERJ-3GEY0R00V; Tech: SMDR; Package: Res Chip 0603; Supplier 1: Digi-Key; Supplier Part Number 1: P0.0GCT-ND
U4 = Flash memory 4Mbit: IC FLASH 4MBIT 50MHZ 8SOIC; Manufacturer: Winbond Electronics; Tech: Surface Mount; Manufacturer No: W25Q40CLSNIG; Supplier 1: Digi-Key; Supplier Part Number 1: W25Q40CLSNIG-ND
U5 U7 = DAC_12bit_8ch: IC DAC 12BIT 16CHAN 3V 52LQFP; Manufacturer: Analog Devices Inc.; Tech: Surface Mount; Manufacturer No: AD5672RBRUZ-ND; Supplier 1: Digi-Key; Supplier Part Number 1: AD5672RBRUZ-ND
U6 = OPAMP_LTC2050CS5: Zero-Drift Operational Amplifier; Manufacturer: Linear Technology; Manufacturer No: LTC2050CS5#TRMPBF; Tech: SMDR; Package: SOT23-5; Supplier 1: Digi-Key; Supplier Part Number 1: LTC2050CS5#TRMPBFCT-ND

## Sheet BMD_RevB_B5_AMP.SchDoc: MPPC
size 401 x 291 mm; DocumentNumber: 2; SheetNumber: 5; SheetTotal: 6
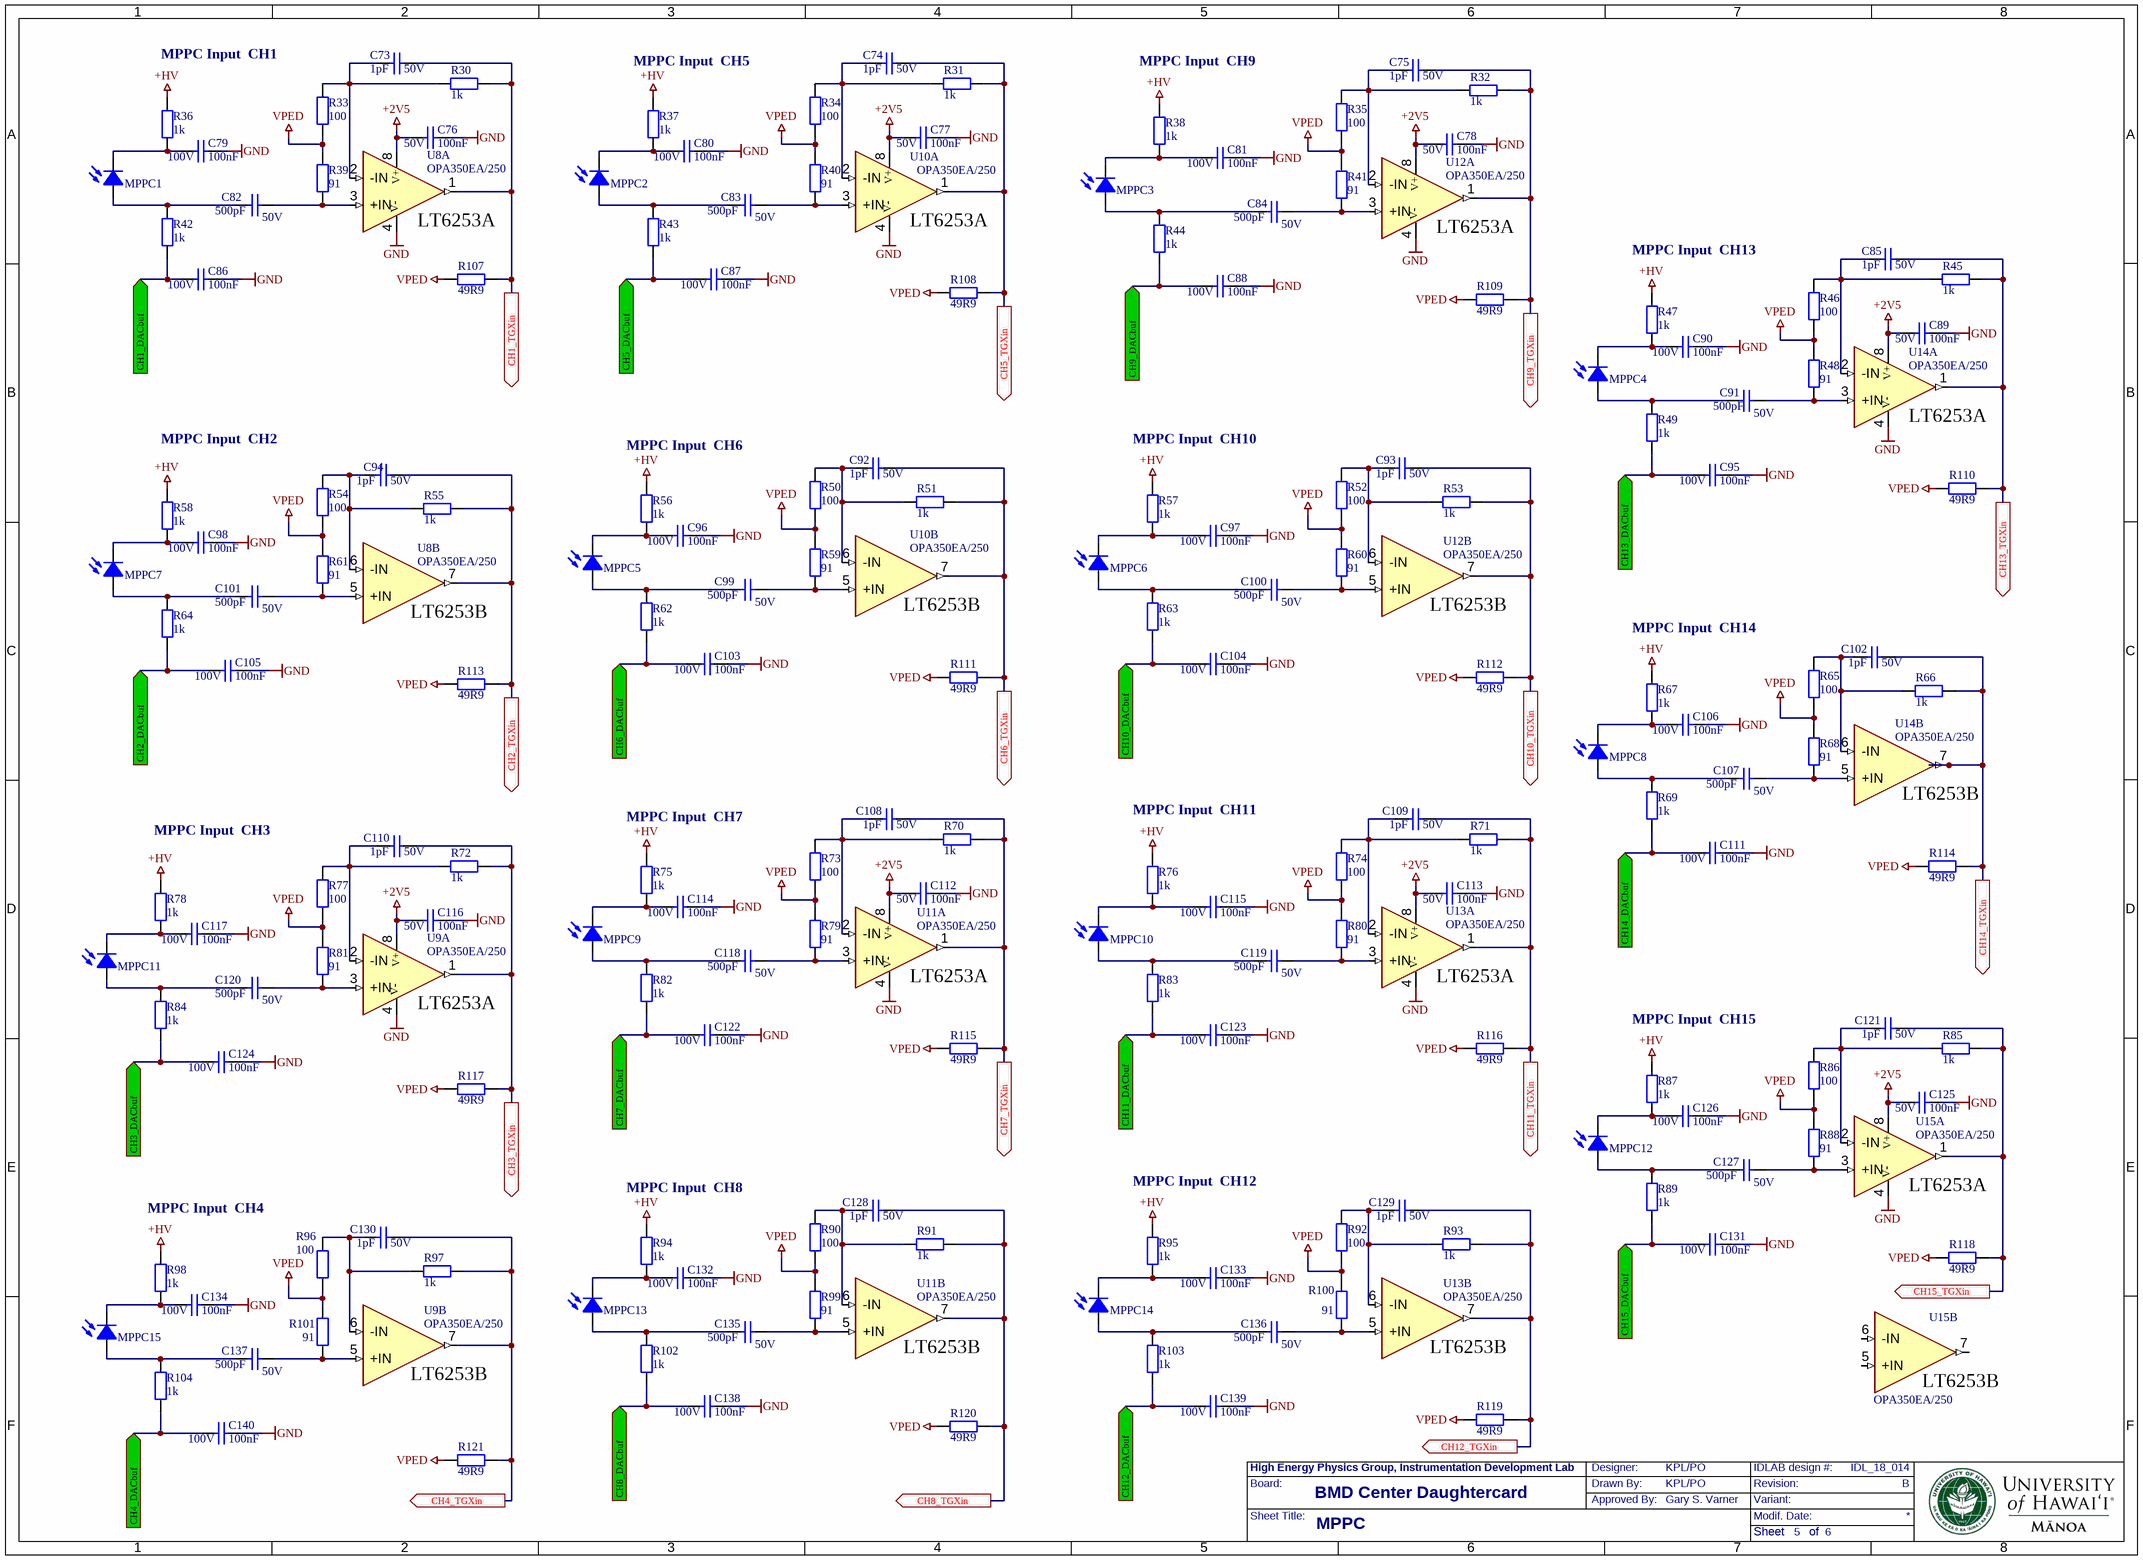
[diagram p4: BMD_RevB_B5_AMP.SchDoc]

### Parts
(Parts that share a designator on the sheet are numbered #1, #2 ... from top to bottom, then left to right.)
C73  1pF  Voltage rating: 50V  [CC0603RF1R]
C74  1pF  Voltage rating: 50V  [CC0603RF1R]
C75  1pF  Voltage rating: 50V  [CC0603RF1R]
C76  100nF  Voltage rating: 50V  [CC0402N1R]
C77  100nF  Voltage rating: 50V  [CC0402N1R]
C78  100nF  Voltage rating: 50V  [CC0402N1R]
C79  100nF  Voltage rating: 100V  [RC0603N1R]
C80  100nF  Voltage rating: 100V  [RC0603N1R]
C81  100nF  Voltage rating: 100V  [RC0603N1R]
C82  500pF  Voltage rating: 50V  [CC0603RF1R]
C83  500pF  Voltage rating: 50V  [CC0603RF1R]
C84  500pF  Voltage rating: 50V  [CC0603RF1R]
C85  1pF  Voltage rating: 50V  [CC0603RF1R]
C86  100nF  Voltage rating: 100V  [RC0603N1R]
C87  100nF  Voltage rating: 100V  [RC0603N1R]
C88  100nF  Voltage rating: 100V  [RC0603N1R]
C89  100nF  Voltage rating: 50V  [CC0402N1R]
C90  100nF  Voltage rating: 100V  [RC0603N1R]
C91  500pF  Voltage rating: 50V  [CC0603RF1R]
C92  1pF  Voltage rating: 50V  [CC0603RF1R]
C93  1pF  Voltage rating: 50V  [CC0603RF1R]
C94  1pF  Voltage rating: 50V  [CC0603RF1R]
C95  100nF  Voltage rating: 100V  [RC0603N1R]
C96  100nF  Voltage rating: 100V  [RC0603N1R]
C97  100nF  Voltage rating: 100V  [RC0603N1R]
C98  100nF  Voltage rating: 100V  [RC0603N1R]
C99  500pF  Voltage rating: 50V  [CC0603RF1R]
C100  500pF  Voltage rating: 50V  [CC0603RF1R]
C101  500pF  Voltage rating: 50V  [CC0603RF1R]
C102  1pF  Voltage rating: 50V  [CC0603RF1R]
C103  100nF  Voltage rating: 100V  [RC0603N1R]
C104  100nF  Voltage rating: 100V  [RC0603N1R]
C105  100nF  Voltage rating: 100V  [RC0603N1R]
C106  100nF  Voltage rating: 100V  [RC0603N1R]
C107  500pF  Voltage rating: 50V  [CC0603RF1R]
C108  1pF  Voltage rating: 50V  [CC0603RF1R]
C109  1pF  Voltage rating: 50V  [CC0603RF1R]
C110  1pF  Voltage rating: 50V  [CC0603RF1R]
C111  100nF  Voltage rating: 100V  [RC0603N1R]
C112  100nF  Voltage rating: 50V  [CC0402N1R]
C113  100nF  Voltage rating: 50V  [CC0402N1R]
C114  100nF  Voltage rating: 100V  [RC0603N1R]
C115  100nF  Voltage rating: 100V  [RC0603N1R]
C116  100nF  Voltage rating: 50V  [CC0402N1R]
C117  100nF  Voltage rating: 100V  [RC0603N1R]
C118  500pF  Voltage rating: 50V  [CC0603RF1R]
C119  500pF  Voltage rating: 50V  [CC0603RF1R]
C120  500pF  Voltage rating: 50V  [CC0603RF1R]
C121  1pF  Voltage rating: 50V  [CC0603RF1R]
C122  100nF  Voltage rating: 100V  [RC0603N1R]
C123  100nF  Voltage rating: 100V  [RC0603N1R]
C124  100nF  Voltage rating: 100V  [RC0603N1R]
C125  100nF  Voltage rating: 50V  [CC0402N1R]
C126  100nF  Voltage rating: 100V  [RC0603N1R]
C127  500pF  Voltage rating: 50V  [CC0603RF1R]
C128  1pF  Voltage rating: 50V  [CC0603RF1R]
C129  1pF  Voltage rating: 50V  [CC0603RF1R]
C130  1pF  Voltage rating: 50V  [CC0603RF1R]
C131  100nF  Voltage rating: 100V  [RC0603N1R]
C132  100nF  Voltage rating: 100V  [RC0603N1R]
C133  100nF  Voltage rating: 100V  [RC0603N1R]
C134  100nF  Voltage rating: 100V  [RC0603N1R]
C135  500pF  Voltage rating: 50V  [CC0603RF1R]
C136  500pF  Voltage rating: 50V  [CC0603RF1R]
C137  500pF  Voltage rating: 50V  [CC0603RF1R]
C138  100nF  Voltage rating: 100V  [RC0603N1R]
C139  100nF  Voltage rating: 100V  [RC0603N1R]
C140  100nF  Voltage rating: 100V  [RC0603N1R]
MPPC1  MPPC  [MPPC S12572-050P]  (value not drawn)
MPPC2  MPPC  [MPPC S12572-050P]  (value not drawn)
MPPC3  MPPC  [MPPC S12572-050P]  (value not drawn)
MPPC4  MPPC  [MPPC S12572-050P]  (value not drawn)
MPPC5  MPPC  [MPPC S12572-050P]  (value not drawn)
MPPC6  MPPC  [MPPC S12572-050P]  (value not drawn)
MPPC7  MPPC  [MPPC S12572-050P]  (value not drawn)
MPPC8  MPPC  [MPPC S12572-050P]  (value not drawn)
MPPC9  MPPC  [MPPC S12572-050P]  (value not drawn)
MPPC10  MPPC  [MPPC S12572-050P]  (value not drawn)
MPPC11  MPPC  [MPPC S12572-050P]  (value not drawn)
MPPC12  MPPC  [MPPC S12572-050P]  (value not drawn)
MPPC13  MPPC  [MPPC S12572-050P]  (value not drawn)
MPPC14  MPPC  [MPPC S12572-050P]  (value not drawn)
MPPC15  MPPC  [MPPC S12572-050P]  (value not drawn)
R30  1k  [RC0603N1R]
R31  1k  [RC0603N1R]
R32  1k  [RC0603N1R]
R33  100  [RC0603N1R]
R34  100  [RC0603N1R]
R35  100  [RC0603N1R]
R36  1k  [RC0805N1R]
R37  1k  [RC0805N1R]
R38  1k  [RC0805N1R]
R39  91  [RC0603N1R]
R40  91  [RC0603N1R]
R41  91  [RC0603N1R]
R42  1k  [RC0603N1R]
R43  1k  [RC0603N1R]
R44  1k  [RC0603N1R]
R45  1k  [RC0603N1R]
R46  100  [RC0603N1R]
R47  1k  [RC0805N1R]
R48  91  [RC0603N1R]
R49  1k  [RC0603N1R]
R50  100  [RC0603N1R]
R51  1k  [RC0603N1R]
R52  100  [RC0603N1R]
R53  1k  [RC0603N1R]
R54  100  [RC0603N1R]
R55  1k  [RC0603N1R]
R56  1k  [RC0805N1R]
R57  1k  [RC0805N1R]
R58  1k  [RC0805N1R]
R59  91  [RC0603N1R]
R60  91  [RC0603N1R]
R61  91  [RC0603N1R]
R62  1k  [RC0603N1R]
R63  1k  [RC0603N1R]
R64  1k  [RC0603N1R]
R65  100  [RC0603N1R]
R66  1k  [RC0603N1R]
R67  1k  [RC0805N1R]
R68  91  [RC0603N1R]
R69  1k  [RC0603N1R]
R70  1k  [RC0603N1R]
R71  1k  [RC0603N1R]
R72  1k  [RC0603N1R]
R73  100  [RC0603N1R]
R74  100  [RC0603N1R]
R75  1k  [RC0805N1R]
R76  1k  [RC0805N1R]
R77  100  [RC0603N1R]
R78  1k  [RC0805N1R]
R79  91  [RC0603N1R]
R80  91  [RC0603N1R]
R81  91  [RC0603N1R]
R82  1k  [RC0603N1R]
R83  1k  [RC0603N1R]
R84  1k  [RC0603N1R]
R85  1k  [RC0603N1R]
R86  100  [RC0603N1R]
R87  1k  [RC0805N1R]
R88  91  [RC0603N1R]
R89  1k  [RC0603N1R]
R90  100  [RC0603N1R]
R91  1k  [RC0603N1R]
R92  100  [RC0603N1R]
R93  1k  [RC0603N1R]
R94  1k  [RC0805N1R]
R95  1k  [RC0805N1R]
R96  100  [RC0603N1R]
R97  1k  [RC0603N1R]
R98  1k  [RC0805N1R]
R99  91  [RC0603N1R]
R100  91  [RC0603N1R]
R101  91  [RC0603N1R]
R102  1k  [RC0603N1R]
R103  1k  [RC0603N1R]
R104  1k  [RC0603N1R]
R107  49R9  [RC0603N1R]
R108  49R9  [RC0603N1R]
R109  49R9  [RC0603N1R]
R110  49R9  [RC0603N1R]
R111  49R9  [RC0603N1R]
R112  49R9  [RC0603N1R]
R113  49R9  [RC0603N1R]
R114  49R9  [RC0603N1R]
R115  49R9  [RC0603N1R]
R116  49R9  [RC0603N1R]
R117  49R9  [RC0603N1R]
R118  49R9  [RC0603N1R]
R119  49R9  [RC0603N1R]
R120  49R9  [RC0603N1R]
R121  49R9  [RC0603N1R]
U8  OPA350EA/250  [MSOP8N]  (parts A,B of 2)
U9  OPA350EA/250  [MSOP8N]  (parts A,B of 2)
U10  OPA350EA/250  [MSOP8N]  (parts A,B of 2)
U11  OPA350EA/250  [MSOP8N]  (parts A,B of 2)
U12  OPA350EA/250  [MSOP8N]  (parts A,B of 2)
U13  OPA350EA/250  [MSOP8N]  (parts A,B of 2)
U14  OPA350EA/250  [MSOP8N]  (parts A,B of 2)
U15#1  OPA350EA/250  [MSOP8N]  (parts A,B of 2)

### Ports
CH1_DACbuf (in), CH1_TGXin (out), CH2_DACbuf (in), CH2_TGXin (out), CH3_DACbuf (in), CH3_TGXin (out), CH4_DACbuf (in), CH4_TGXin (out), CH5_DACbuf (in), CH5_TGXin (out), CH6_DACbuf (in), CH6_TGXin (out), CH7_DACbuf (in), CH7_TGXin (out), CH8_DACbuf (in), CH8_TGXin (out), CH9_DACbuf (in), CH9_TGXin (out), CH10_DACbuf (in), CH10_TGXin (out), CH11_DACbuf (in), CH11_TGXin (out), CH12_DACbuf (in), CH12_TGXin (out), CH13_DACbuf (in), CH13_TGXin (out), CH14_DACbuf (in), CH14_TGXin (out), CH15_DACbuf (in), CH15_TGXin (out)

### Nets
+2V5: C76.2 C77.2 C78.2 C89.2 C112.2 C113.2 C116.2 C125.2 U8.8(V+) U9.8(V+) U10.8(V+) U11.8(V+) U12.8(V+) U13.8(V+) U14.8(V+) U15#1.8(V+)
+HV: R36.1 R37.1 R38.1 R47.1 R56.1 R57.1 R58.1 R67.1 R75.1 R76.1 R78.1 R87.1 R94.1 R95.1 R98.1
GND: C76.1 C77.1 C78.1 C79.2 C80.2 C81.2 C86.2 C87.2 C88.2 C89.1 C90.2 C95.2 C96.2 C97.2 C98.2 C103.2 C104.2 C105.2 C106.2 C111.2 C112.1 C113.1 C114.2 C115.2 C116.1 C117.2 C122.2 C123.2 C124.2 C125.1 C126.2 C131.2 C132.2 C133.2 C134.2 C138.2 C139.2 C140.2 U8.4(V-) U9.4(V-) U10.4(V-) U11.4(V-) U12.4(V-) U13.4(V-) U14.4(V-) U15#1.4(V-)
VPED: R33.1 R34.1 R35.1 R39.1 R40.1 R41.1 R46.1 R48.1 R50.1 R52.1 R54.1 R59.2 R60.2 R61.2 R65.1 R68.2 R73.1 R74.1 R77.1 R79.1 R80.1 R81.1 R86.1 R88.1 R90.1 R92.1 R96.1 R99.2 R100.2 R101.2 R107.1 R108.1 R109.1 R110.1 R111.1 R112.1 R113.1 R114.1 R115.1 R116.1 R117.1 R118.1 R119.1 R120.1 R121.1
CH1_DACbuf: C86.1 R42.1 ; port CH1_DACbuf
CH1_TGXin: C73.2 R30.2 R107.2 U8.1(OUT) ; port CH1_TGXin
CH2_DACbuf: C105.1 R64.1 ; port CH2_DACbuf
CH2_TGXin: C94.2 R55.2 R113.2 U8.7(OUT) ; port CH2_TGXin
CH3_DACbuf: C124.1 R84.1 ; port CH3_DACbuf
CH3_TGXin: C110.2 R72.2 R117.2 U9.1(OUT) ; port CH3_TGXin
CH4_DACbuf: C140.1 R104.1 ; port CH4_DACbuf
CH4_TGXin: C130.2 R97.2 R121.2 U9.7(OUT) ; port CH4_TGXin
CH5_DACbuf: C87.1 R43.1 ; port CH5_DACbuf
CH5_TGXin: C74.2 R31.2 R108.2 U10.1(OUT) ; port CH5_TGXin
CH6_DACbuf: C103.1 R62.1 ; port CH6_DACbuf
CH6_TGXin: C92.2 R51.2 R111.2 U10.7(OUT) ; port CH6_TGXin
CH7_DACbuf: C122.1 R82.1 ; port CH7_DACbuf
CH7_TGXin: C108.2 R70.2 R115.2 U11.1(OUT) ; port CH7_TGXin
CH8_DACbuf: C138.1 R102.1 ; port CH8_DACbuf
CH8_TGXin: C128.2 R91.2 R120.2 U11.7(OUT) ; port CH8_TGXin
CH9_DACbuf: C88.1 R44.1 ; port CH9_DACbuf
CH9_TGXin: C75.2 R32.2 R109.2 U12.1(OUT) ; port CH9_TGXin
CH10_DACbuf: C104.1 R63.1 ; port CH10_DACbuf
CH10_TGXin: C93.2 R53.2 R112.2 U12.7(OUT) ; port CH10_TGXin
CH11_DACbuf: C123.1 R83.1 ; port CH11_DACbuf
CH11_TGXin: C109.2 R71.2 R116.2 U13.1(OUT) ; port CH11_TGXin
CH12_DACbuf: C139.1 R103.1 ; port CH12_DACbuf
CH12_TGXin: C129.2 R93.2 R119.2 U13.7(OUT) ; port CH12_TGXin
CH13_DACbuf: C95.1 R49.1 ; port CH13_DACbuf
CH13_TGXin: C85.2 R45.2 R110.2 U14.1(OUT) ; port CH13_TGXin
CH14_DACbuf: C111.1 R69.1 ; port CH14_DACbuf
CH14_TGXin: C102.2 R66.2 R114.2 U14.7(OUT) ; port CH14_TGXin
CH15_DACbuf: C131.1 R89.1 ; port CH15_DACbuf
CH15_TGXin: C121.2 R85.2 R118.2 U15#1.1(OUT) ; port CH15_TGXin
NetC73_1: C73.1 R30.1 R33.2 U8.2(-IN)
NetC74_1: C74.1 R31.1 R34.2 U10.2(-IN)
NetC75_1: C75.1 R32.1 R35.2 U12.2(-IN)
NetC79_1: C79.1 MPPC1.2(C) R36.2
NetC80_1: C80.1 MPPC2.2(C) R37.2
NetC81_1: C81.1 MPPC3.2(C) R38.2
NetC82_1: C82.1 MPPC1.1(A) R42.2
NetC82_2: C82.2 R39.2 U8.3(+IN)
NetC83_1: C83.1 MPPC2.1(A) R43.2
NetC83_2: C83.2 R40.2 U10.3(+IN)
NetC84_1: C84.1 MPPC3.1(A) R44.2
NetC84_2: C84.2 R41.2 U12.3(+IN)
NetC85_1: C85.1 R45.1 R46.2 U14.2(-IN)
NetC90_1: C90.1 MPPC4.2(C) R47.2
NetC91_1: C91.1 MPPC4.1(A) R49.2
NetC91_2: C91.2 R48.2 U14.3(+IN)
NetC92_1: C92.1 R50.2 R51.1 U10.6(-IN)
NetC93_1: C93.1 R52.2 R53.1 U12.6(-IN)
NetC94_1: C94.1 R54.2 R55.1 U8.6(-IN)
NetC96_1: C96.1 MPPC5.2(C) R56.2
NetC97_1: C97.1 MPPC6.2(C) R57.2
NetC98_1: C98.1 MPPC7.2(C) R58.2
NetC99_1: C99.1 MPPC5.1(A) R62.2
NetC99_2: C99.2 R59.1 U10.5(+IN)
NetC100_1: C100.1 MPPC6.1(A) R63.2
NetC100_2: C100.2 R60.1 U12.5(+IN)
NetC101_1: C101.1 MPPC7.1(A) R64.2
NetC101_2: C101.2 R61.1 U8.5(+IN)
NetC102_1: C102.1 R65.2 R66.1 U14.6(-IN)
NetC106_1: C106.1 MPPC8.2(C) R67.2
NetC107_1: C107.1 MPPC8.1(A) R69.2
NetC107_2: C107.2 R68.1 U14.5(+IN)
NetC108_1: C108.1 R70.1 R73.2 U11.2(-IN)
NetC109_1: C109.1 R71.1 R74.2 U13.2(-IN)
NetC110_1: C110.1 R72.1 R77.2 U9.2(-IN)
NetC114_1: C114.1 MPPC9.2(C) R75.2
NetC115_1: C115.1 MPPC10.2(C) R76.2
NetC117_1: C117.1 MPPC11.2(C) R78.2
NetC118_1: C118.1 MPPC9.1(A) R82.2
NetC118_2: C118.2 R79.2 U11.3(+IN)
NetC119_1: C119.1 MPPC10.1(A) R83.2
NetC119_2: C119.2 R80.2 U13.3(+IN)
NetC120_1: C120.1 MPPC11.1(A) R84.2
NetC120_2: C120.2 R81.2 U9.3(+IN)
NetC121_1: C121.1 R85.1 R86.2 U15#1.2(-IN)
NetC126_1: C126.1 MPPC12.2(C) R87.2
NetC127_1: C127.1 MPPC12.1(A) R89.2
NetC127_2: C127.2 R88.2 U15#1.3(+IN)
NetC128_1: C128.1 R90.2 R91.1 U11.6(-IN)
NetC129_1: C129.1 R92.2 R93.1 U13.6(-IN)
NetC130_1: C130.1 R96.2 R97.1 U9.6(-IN)
NetC132_1: C132.1 MPPC13.2(C) R94.2
NetC133_1: C133.1 MPPC14.2(C) R95.2
NetC134_1: C134.1 MPPC15.2(C) R98.2
NetC135_1: C135.1 MPPC13.1(A) R102.2
NetC135_2: C135.2 R99.1 U11.5(+IN)
NetC136_1: C136.1 MPPC14.1(A) R103.2
NetC136_2: C136.2 R100.1 U13.5(+IN)
NetC137_1: C137.1 MPPC15.1(A) R104.2
NetC137_2: C137.2 R101.1 U9.5(+IN)

Not connected (* = marked no-connect by the designer): U15#1 5(+IN) 6(-IN) 7(OUT)

### Notes on the sheet
- MPPC Input  CH1
- (near R37) MPPC Input  CH5
- (near R38) MPPC Input  CH9
- MPPC Input  CH13
- MPPC Input  CH2
- (near R56) MPPC Input  CH6
- (near R57) MPPC Input  CH10
- MPPC Input  CH14
- MPPC Input  CH3
- (near R75) MPPC Input  CH7
- (near R76) MPPC Input  CH11
- MPPC Input  CH15
- MPPC Input  CH4
- (near R94) MPPC Input  CH8
- (near R95) MPPC Input  CH12
- Board:
- High Energy Physics Group, Instrumentation Development Lab
- Drawn By:
- Designer:
- Approved By:
- Revision:
- IDLAB design #:
- Variant:
- Sheet Title:
- Modif. Date:
- Sheet       of
- (in symbol OPAMP_LT6253CMS8, part A) LT6253A
- (in symbol OPAMP_LT6253CMS8, part B) LT6253B

### Library data of the parts
C73-C75 C85 C92-C94 C102 C108-C110 C121 C128-C130 = CAPCC0603_1P_50VNPO: 100pF 50V Ceramic Capacitor C0G, NP0 0603; Manufacturer: AVX Corporation; Manufacturer No: ML03511R0BAT2A; Tech: SMDR; Package: Cap Chip 0603; Supplier 1: Digi-Key; Supplier Part Number 1: 478-6707-6-ND
C76-C78 C89 C112 C113 C116 C125 = CAPCC0402_100N_50VX7R: as C1 on sheet BMD_RevB_B2_TX; Package: Cap Chip 0402; Supplier 1: Digi-Key; Supplier Part Number 1: 445-5932-1-ND
C79-C81 C86-C88 C90 C95-C98 C103-C106 C111 C114 C115 C117 C122-C124 C126 C131-C134 C138-C140 = CAPCC0603_100N100VX7R: 0.10µF 100V Ceramic Capacitor X7R 0603; Manufacturer: Yageo; Manufacturer No: CC0603KRX7R0BB104; Tech: SMDR; Supplier 1: Digi-Key; Supplier Part Number 1: 311-1523-1-ND
C82-C84 C91 C99-C101 C107 C118-C120 C127 C135-C137 = CAPCC0603_500P_50VNPO: 100pF 50V Ceramic Capacitor C0G, NP0 0603; Manufacturer: KEMET; Manufacturer No: C0603C511J5GACTU; Tech: SMDR; Package: Cap Chip 0603; Supplier 1: Digi-Key; Supplier Part Number 1: 399-9102-6-ND
MPPC1-MPPC15 = MPPC: 3x3mm Multi-Pixel photon counter; Manufacturer: HAMAMATSU; Manufacturer No: S12572-050; Tech: SMD_manual; Package: S12572-050P; Supplier 1: HAMAMATSU; Supplier Part Number 1: S12572-050; Supplier Order Qty 1: 1; Supplier Unit Price 1: 0
R30-R32 R42-R45 R49 R51 R53 R55 R62-R64 R66 R69-R72 R82-R85 R89 R91 R93 R97 R102-R104 = RES0603-1K-1%100PPM: RES SMD 1K OHM 1% 1/10W 0603; Manufacturer: Yageo; Manufacturer No: RC0603FR-071KL; Tech: SMDR; Package: Res Chip 0603; Supplier 1: Digi-Key; Supplier Part Number 1: 311-1.00KHRCT-ND
R33-R35 R46 R50 R52 R54 R65 R73 R74 R77 R86 R90 R92 R96 = RES0603-100-1%100PPM: RES SMD 1K OHM 1% 1/10W 0603; Manufacturer: Stackpole Electronics Inc.; Manufacturer No: RNCP0603FTD100R; Tech: SMDR; Package: Res Chip 0603; Supplier 1: Digi-Key; Supplier Part Number 1: RNCP0603FTD100RDKR-ND
R36-R38 R47 R56-R58 R67 R75 R76 R78 R87 R94 R95 R98 = RES0805-1K-1%100PPM Precision: RES SMD 1K OHM 1% 1/4W 0805; Manufacturer: Bourns Inc.; Manufacturer No: CRS0805-FX-1001ELF; Tech: SMDR; Package: Res Chip 0805; Supplier 1: Digi-Key; Supplier Part Number 1: CRS0805-FX-1001ELFCT-ND
R39-R41 R48 R59-R61 R68 R79-R81 R88 R99-R101 = RES0603-91-1%100PPM: RES SMD 91 OHM 1% 1/10W 0603; Manufacturer: Yageo; Manufacturer No: RC0603FR-0791RL; Tech: SMDR; Package: Res Chip 0603; Supplier 1: Digi-Key; Supplier Part Number 1: 311-91.0HRDKR-ND
R107-R121 = RES0603-0-49.9R-1%100PPM: Chip Resistor 0603 100mW 1% 100ppm; Manufacturer: Panasonic; Manufacturer No: ERJ-3EKF49R9V; Tech: SMDR; Package: Res Chip 0603; Supplier 1: Digi-Key; Supplier Part Number 1: P49.9HDKR-ND; Supplier 2: Mouser; Supplier Part Number 2: 667-ERJ-3EKF49R9V; Supplier 3: Newark; Supplier Part Number 3: 65T8468
U8-U14 U15#1 = OPAMP_LT6253CMS8: Single-Supply, Rail-to-Rail, 720MHZ; Manufacturer: Linear Technology/Analog Devices; Manufacturer No: LTC6253CMS8#PBF; Tech: SMDR; Package: MSOP8; Supplier 1: Digi-Key; Supplier Part Number 1: LTC6253CMS8#PBF-ND